# Altium project SamplerBoard.PrjPcb
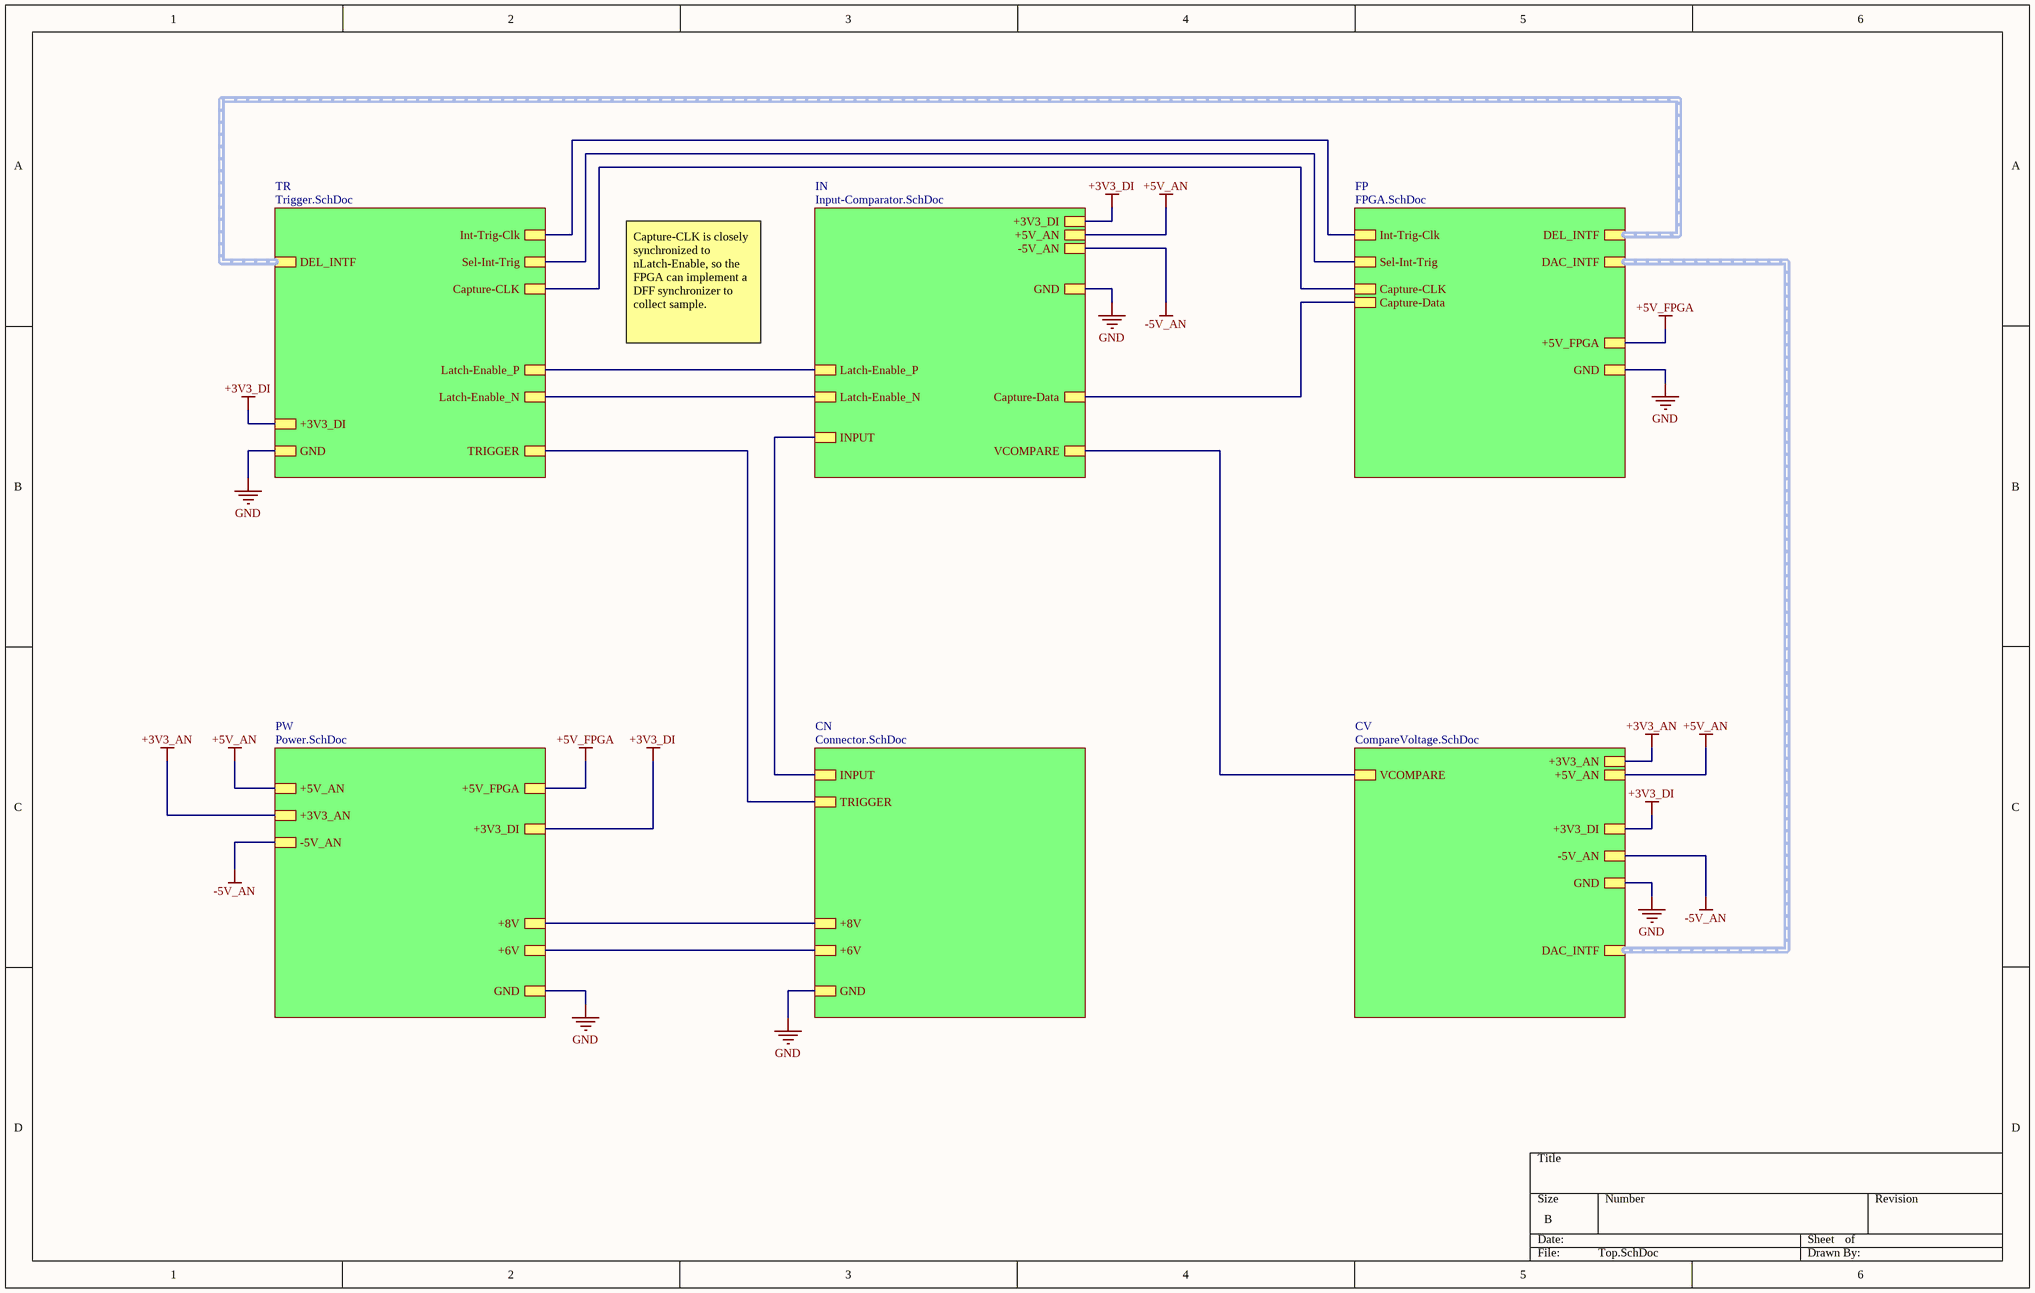
[diagram p0: Top.SchDoc]
7 sheets, 99 parts. Net scope: strictly hierarchical (ports join the sheet entries above them; power ports are local).
Board file: PCB.PcbDoc
Sheets:
  Top.SchDoc
    TR = Trigger.SchDoc
    IN = Input-Comparator.SchDoc
    FP = FPGA.SchDoc
    PW = Power.SchDoc
    CN = Connector.SchDoc
    CV = CompareVoltage.SchDoc

## Sheet Top.SchDoc
size B

### Sub-sheets
CN = Connector.SchDoc: GND, INPUT, TRIGGER, +6V, +8V
CV = CompareVoltage.SchDoc: VCOMPARE, GND, +3V3_AN, +5V_AN, -5V_AN, DAC_INTF (harness DAC_PINS), +3V3_DI
FP = FPGA.SchDoc: DAC_INTF (harness DAC_PINS), +5V_FPGA, GND, Capture-CLK, Int-Trig-Clk, Sel-Int-Trig, DEL_INTF (harness DAC_PINS), Capture-Data
IN = Input-Comparator.SchDoc: GND, +3V3_DI, +5V_AN, -5V_AN, VCOMPARE, INPUT, Latch-Enable_P, Latch-Enable_N, Capture-Data
PW = Power.SchDoc: +5V_FPGA, GND, +3V3_AN, +5V_AN, +3V3_DI, -5V_AN, +6V, +8V
TR = Trigger.SchDoc: TRIGGER, GND, +3V3_DI, Latch-Enable_P, Latch-Enable_N, Sel-Int-Trig, Capture-CLK, Int-Trig-Clk, DEL_INTF

### Nets
+3V3_AN: sheet PW/+3V3_AN, sheet CV/+3V3_AN
+3V3_DI: sheet TR/+3V3_DI, sheet IN/+3V3_DI, sheet PW/+3V3_DI, sheet CV/+3V3_DI
+5V_AN: sheet IN/+5V_AN, sheet PW/+5V_AN, sheet CV/+5V_AN
+5V_FPGA: sheet FP/+5V_FPGA, sheet PW/+5V_FPGA
+6V: sheet PW/+6V, sheet CN/+6V
+8V: sheet PW/+8V, sheet CN/+8V
-5V_AN: sheet IN/-5V_AN, sheet PW/-5V_AN, sheet CV/-5V_AN
GND: sheet TR/GND, sheet IN/GND, sheet FP/GND, sheet PW/GND, sheet CN/GND, sheet CV/GND
Latch-Enable_N: sheet TR/Latch-Enable_N, sheet IN/Latch-Enable_N
Latch-Enable_P: sheet TR/Latch-Enable_P, sheet IN/Latch-Enable_P
VCOMPARE: sheet IN/VCOMPARE, sheet CV/VCOMPARE
NetBB1_2: sheet TR/Capture-CLK, sheet FP/Capture-CLK
NetBB1_3: sheet IN/Capture-Data, sheet FP/Capture-Data
NetBB1_5: sheet TR/Sel-Int-Trig, sheet FP/Sel-Int-Trig
NetDB1_2: sheet TR/Int-Trig-Clk, sheet FP/Int-Trig-Clk
NetJ1_1: sheet IN/INPUT, sheet CN/INPUT
NetJ2_1: sheet TR/TRIGGER, sheet CN/TRIGGER

### Buses and harness runs
harness sheet CV/DAC_INTF = sheet FP/DAC_INTF
harness sheet FP/DEL_INTF = sheet TR/DEL_INTF

### Notes on the sheet
- Capture-CLK is closely synchronized to nLatch-Enable, so the FPGA can implement a DFF synchronizer to collect sample.

## Sheet Trigger.SchDoc
size B
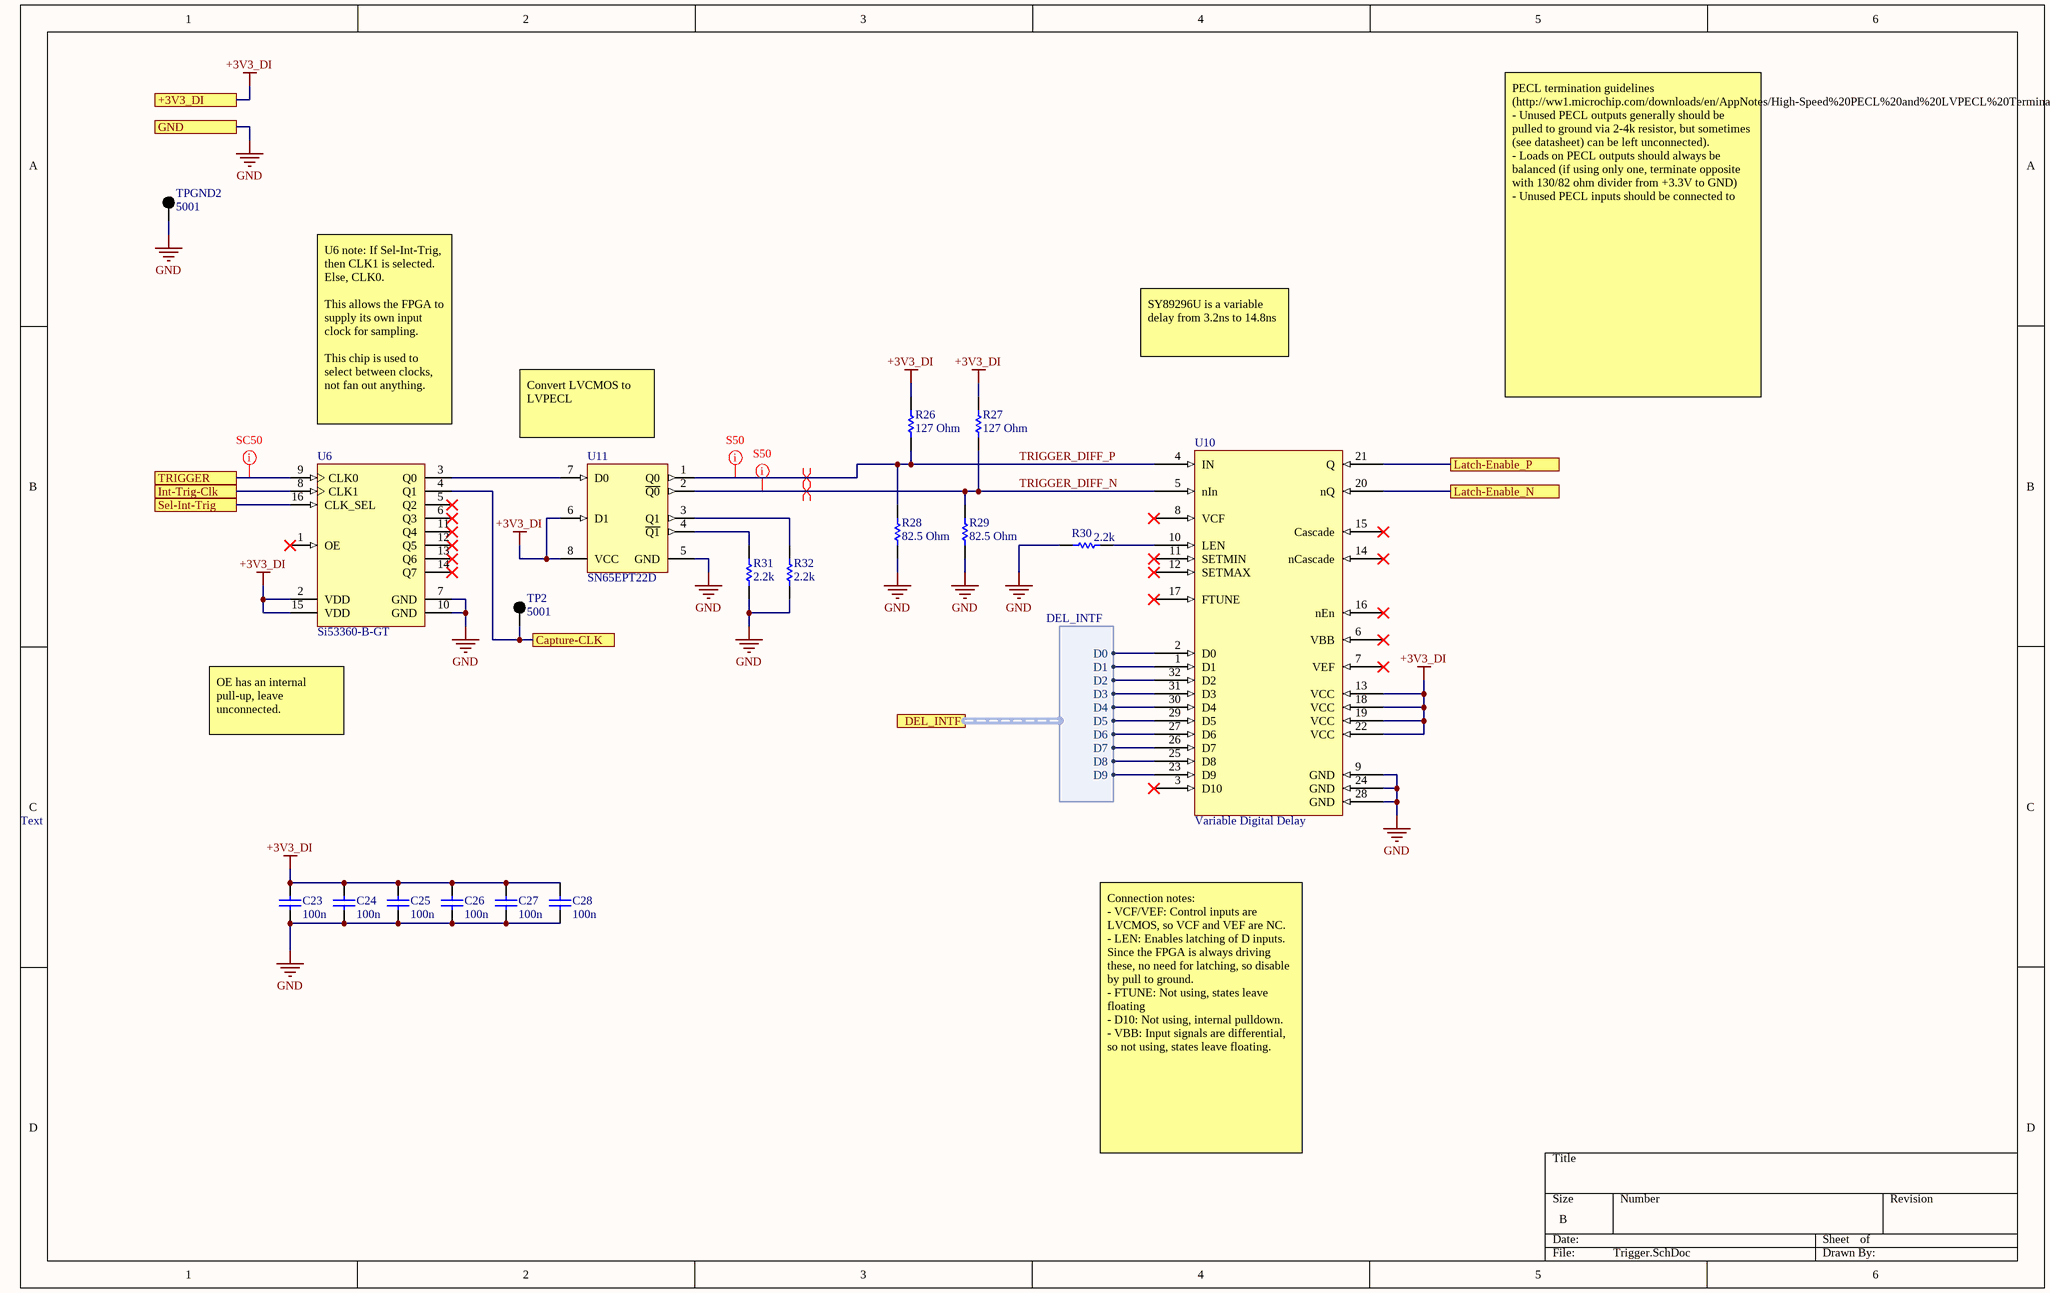
[diagram p1: Trigger.SchDoc]

### Parts
C23  value 100n  [CAPC2013X88X50NL20T25]  (hidden comment: C0805C104K5RACTU)
C24  value 100n  [CAPC2013X88X50NL20T25]  (hidden comment: C0805C104K5RACTU)
C25  value 100n  [CAPC2013X88X50NL20T25]  (hidden comment: C0805C104K5RACTU)
C26  value 100n  [CAPC2013X88X50NL20T25]  (hidden comment: C0805C104K5RACTU)
C27  value 100n  [CAPC2013X88X50NL20T25]  (hidden comment: C0805C104K5RACTU)
C28  value 100n  [CAPC2013X88X50NL20T25]  (hidden comment: C0805C104K5RACTU)
R26  127 Ohm  [RESC2013X50X30NL20T20]
R27  127 Ohm  [RESC2013X50X30NL20T20]
R28  82.5 Ohm  [RESC2013X50X30ML20T20]
R29  82.5 Ohm  [RESC2013X50X30ML20T20]
R30  2.2k  [RESC2013X50X30NL20T20]
R31  2.2k  [RESC2013X50X30NL20T20]
R32  2.2k  [RESC2013X50X30NL20T20]
TP2  5001  [KSTN-5001]
TPGND2  5001  [KSTN-5001]
U6  Si53360-B-GT  [SLAB-TSSOP-16_M]
U10  Variable Digital Delay  [CQFP80P1115X1115X120-32N]
U11  SN65EPT22D  [D0008A_M]

### Ports
+3V3_DI, Capture-CLK, DEL_INTF (harness DEL_INTF), GND, Int-Trig-Clk, Latch-Enable_N, Latch-Enable_P, Sel-Int-Trig, TRIGGER

### Harnesses
DEL_INTF: D0, D1, D2, D3, D4, D5, D6, D7, D8, D9

### Nets
+3V3_DI: C23.2 C24.2 C25.2 C26.2 C27.2 C28.2 R26.2 R27.2 U6.2(VDD) U6.15(VDD) U10.13(VCC) U10.18(VCC) U10.19(VCC) U10.22(VCC) U11.6(D1) U11.8(VCC) ; port +3V3_DI
GND: C23.1 C24.1 C25.1 C26.1 C27.1 C28.1 R28.1 R29.1 R30.1 R31.2 R32.2 TPGND2.1 U6.7(GND) U6.10(GND) U10.9(GND) U10.24(GND) U10.28(GND) U11.5(GND) ; port GND
D0: U10.2(D0) ; port DEL_INTF.D0
D1: U10.1(D1) ; port DEL_INTF.D1
D2: U10.32(D2) ; port DEL_INTF.D2
D3: U10.31(D3) ; port DEL_INTF.D3
D4: U10.30(D4) ; port DEL_INTF.D4
D5: U10.29(D5) ; port DEL_INTF.D5
D6: U10.27(D6) ; port DEL_INTF.D6
D7: U10.26(D7) ; port DEL_INTF.D7
D8: U10.25(D8) ; port DEL_INTF.D8
D9: U10.23(D9) ; port DEL_INTF.D9
Latch-Enable_N: U10.20(nQ) ; port Latch-Enable_N
Latch-Enable_P: U10.21(Q) ; port Latch-Enable_P
TRIGGER_DIFF_N: R27.1 R29.2 U10.5(nIn) U11.2(~{Q0})
TRIGGER_DIFF_P: R26.1 R28.2 U10.4(IN) U11.1(Q0)
NetBB1_2: TP2.1 U6.4(Q1) ; port Capture-CLK
NetBB1_5: U6.16(CLK_SEL) ; port Sel-Int-Trig
NetDB1_2: U6.8(CLK1) ; port Int-Trig-Clk
NetJ2_1: U6.9(CLK0) ; port TRIGGER
NetR30_2: R30.2 U10.10(LEN)
NetR31_1: R31.1 U11.4(~{Q1})
NetR32_1: R32.1 U11.3(Q1)
NetU6_3: U6.3(Q0) U11.7(D0)

Not connected (* = marked no-connect by the designer): U6 1(OE)* 5(Q2)* 6(Q3)* 11(Q4)* 12(Q5)* 13(Q6)* 14(Q7)*; U10 3(D10)* 6(VBB)* 7(VEF)* 8(VCF)* 11(SETMIN)* 12(SETMAX)* 14(nCascade)* 15(Cascade)* 16(nEn)* 17(FTUNE)*

### Layout directives
net class SC50: NetJ2_1
net class S50: TRIGGER_DIFF_N, TRIGGER_DIFF_P
differential pair: TRIGGER_DIFF_N, TRIGGER_DIFF_P

### Notes on the sheet
- SY89296U is a variable delay from 3.2ns to 14.8ns
- U6 note: If Sel-Int-Trig, then CLK1 is selected. Else, CLK0.
  This allows the FPGA to supply its own input clock for sampling.
  This chip is used to select between clocks, not fan out anything.
- (near U11) Convert LVCMOS to LVPECL
- PECL termination guidelines (http://ww1.microchip.com/downloads/en/AppNotes/High-Speed%20PECL%20and%20LVPECL%20Termination.pdf):
  - Unused PECL outputs generally should be pulled to ground via 2-4k resistor, but sometimes (see datasheet) can be left unconnected).
  - Loads on PECL outputs should always be balanced (if using only one, terminate opposite with 130/82 ohm divider from +3.3V to GND)
  - Unused PECL inputs should be connected to
- OE has an internal pull-up, leave unconnected.
- Text
- Connection notes:
  - VCF/VEF: Control inputs are LVCMOS, so VCF and VEF are NC.
  - LEN: Enables latching of D inputs. Since the FPGA is always driving these, no need for latching, so disable by pull to ground.
  - FTUNE: Not using, states leave floating
  - D10: Not using, internal pulldown.
  - VBB: Input signals are differential, so not using, states leave floating.

### Library data of the parts
C23-C28 = CMP-2007-00279-1: Manufacturer: Kemet; Part Number: C0805C104K5RACTU
R26 R27 = CMP-2001-04933-1: Manufacturer: Vishay Dale; Part Number: CRCW0805127RFKEA
R28 R29 = CMP-2001-04138-1: Part Number: CRCW080582R5FKEA; Manufacturer: Vishay Dale
R30-R32 = CMP-2001-03760-1: Part Number: CRCW08052K20FKEA; Manufacturer: Vishay Dale
TP2 TPGND2 = CMP-2000-05181-1: Test Point, Black, 1-Pin THD, RoHS, Bulk; Manufacturer: Keystone; Other Names: 5001K; Catalog Drawings: 5000Series; Alternate Color: 5004K-ND / -TESTPOINTPCMINI.040"DYELLOW / 5003K-ND / -TESTPOINTPCMINI.040"DORANGE / 5002K-ND / -TESTPOINTPCMINI.040"DWHITE / 5000K-ND / -TESTPOINTPCMINI.040"DRED; Kits: DKTGRS232C-KIT-ND / -TTLCONVERTER; Online Catalog: ColorCodedTestPoints; Datasheet URL: https://ciiva.com/datasheet-click-2917627?src=ciiva&sig=bd195616; Mounting Type: 0.040"(1.02mm)HoleDiameter; Family: TestPoints; RoHS Information: RoHSComplianceStatement; Datasheet Version: Rev. G, 12/2008; Color: Black; Category: TestandMeasurement; Standard Package: 100; Manufacturer URL: http://www.keyelco.com/; Material: Base,Nylon46,UL94V-0; Type: PCTestPoint,Miniature; Terminal: 0.010"x0.020"(0.25mmx0.51mm)PhosphorBronzeWire,SilverPlated; Series: THM; Packaging: Bulk
U6 = CMP-0510-00562-1: 1:8 Low Jitter CMOS Clock Buffer with 2:1 Input Mux, 1 to 200 MHz, -40 to 85 degC, 16-pin SOP; Manufacturer: Silicon Labs; Sub-Family: Clock Buffers; Output Format: LVCMOS; Frequency (MHz): 1 to 200; Mounting Technology: Surface Mount; ComponentLink3Description: Package Specification; PartNumber: Si53360-B-GT; PackageReference: TSSOP-16; ComponentLink2URL: http://www.silabs.com/Support%20Documents/TechnicalDocs/Si53360.pdf; DatasheetVersion: Rev. 0.4; Code_IPC: J-STD-020C; PackageDescription: 16-Pin Thin Shrink Small-Outline Package, Body 5 x 4.4 mm, Pitch 0.65 mm; Code_JEDEC: MO-153; ComponentLink1Description: Manufacturer URL; ComponentLink3URL: http://www.silabs.com/Support%20Documents/TechnicalDocs/Si53360.pdf; ComponentLink2Description: Datasheet; ComponentLink1URL: http://www.silabs.com/
U10 = SY89296U
U11 = CMP-0327-00041-3: 4000 Mbps 3.3 V Dual LVTTL / LVCMOS to Differential LVPECL Buffer, 2 Tx and 2 Rx, -40 to +85 degC, 8-pin SOIC (D), Green (RoHS & no Sb/Br); Manufacturer: Texas Instruments; No. of Tx: 2; SubFamily: PECL PHY; ICC(Max)(mA): 50; Signaling Rate(Mbps): 4000; xECL: TRUE; Input Signal: LVTTL, CMOS; PackageDescription: 8-Pin Plastic Small Outline Integrated Circuit, 4.9 x 3.9 mm, Pitch 1.27 mm Pitch; ComponentLink1Description: Manufacturer URL; No. of Rx: 2; Eco-Plan: Green (RoHS & no Sb/Br); Mounting Technology: Surface Mount; ComponentLink2URL: http://www.ti.com/general/docs/lit/getliterature.tsp?genericPartNumber=SN65EPT22&fileType=pdf; ComponentLink3URL: SamplesURL:http://www.ti.com/product/sn65ept22#samples; DatasheetVersion: SLLS926A; PartNumber: SN65EPT22D; PackageReference: D0008A; ComponentLink2Description: Datasheet; ComponentLink1URL: http://www.ti.com/; ComponentLink3Description: URL Link1; Output Signal: LVPECL; PackageVersion: revM, Jun-2011

## Sheet Input-Comparator.SchDoc
size B
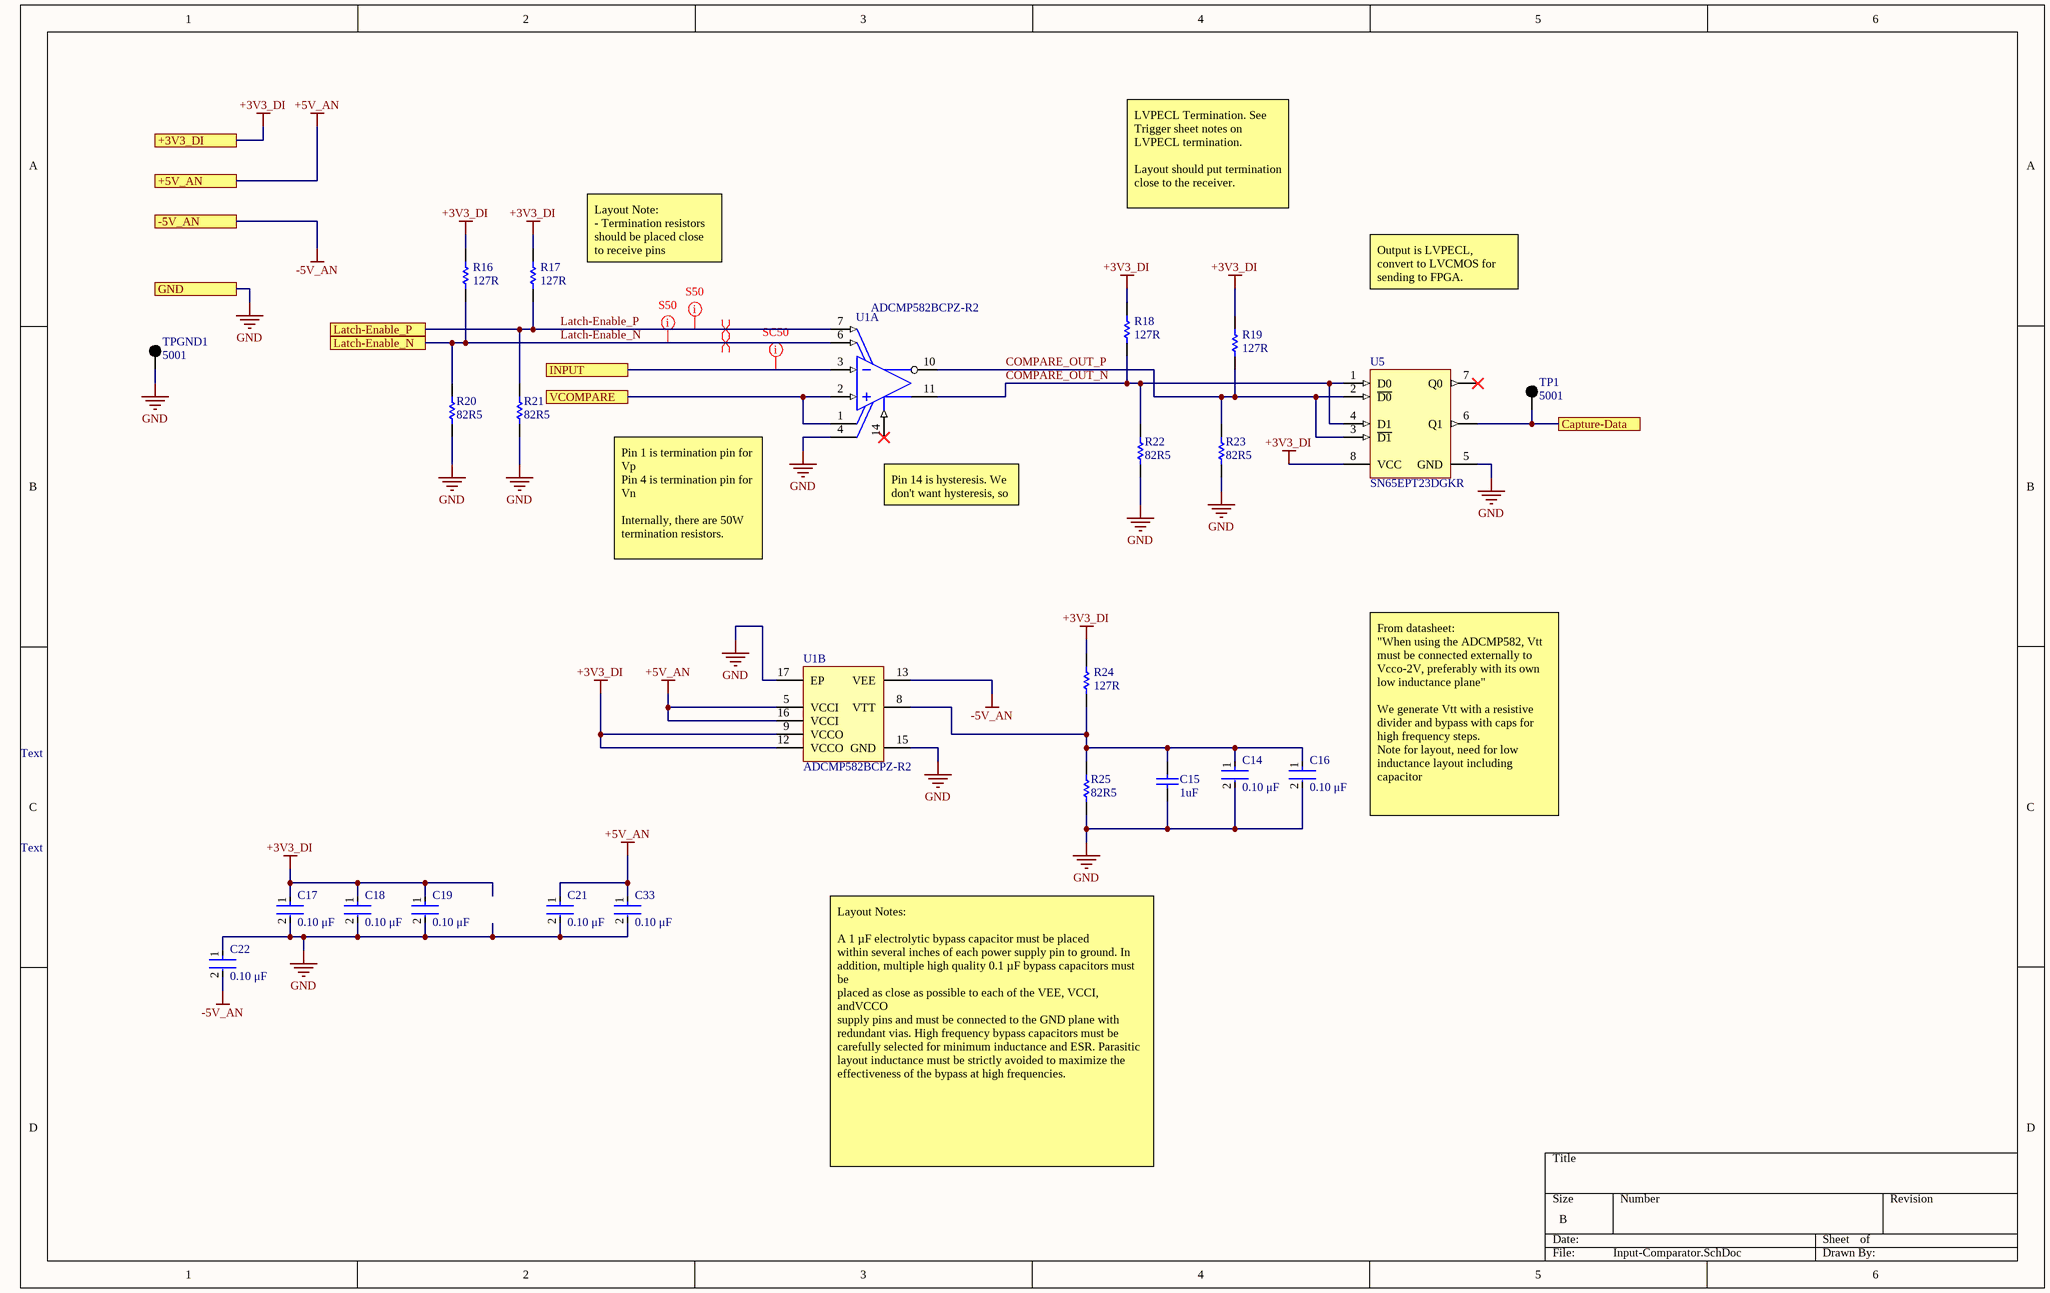
[diagram p2: Input-Comparator.SchDoc]

### Parts
C14  Capacitance: 0.10 μF  [FP-C0402-BB-MFG]  (hidden comment: C0402C104K8PACTU)
C15  1uF  [CAPC2013X100X50NL20T25]
C16  Capacitance: 0.10 μF  [FP-C0402-BB-MFG]  (hidden comment: C0402C104K8PACTU)
C17  Capacitance: 0.10 μF  [FP-C0402-BB-MFG]  (hidden comment: C0402C104K8PACTU)
C18  Capacitance: 0.10 μF  [FP-C0402-BB-MFG]  (hidden comment: C0402C104K8PACTU)
C19  Capacitance: 0.10 μF  [FP-C0402-BB-MFG]  (hidden comment: C0402C104K8PACTU)
C21  Capacitance: 0.10 μF  [FP-C0402-BB-MFG]  (hidden comment: C0402C104K8PACTU)
C22  Capacitance: 0.10 μF  [FP-C0402-BB-MFG]  (hidden comment: C0402C104K8PACTU)
C33  Capacitance: 0.10 μF  [FP-C0402-BB-MFG]  (hidden comment: C0402C104K8PACTU)
R16  value 127R  [RESC1005X40X25LL05T10]  (hidden comment: RC0402FR-07127RL)
R17  value 127R  [RESC1005X40X25LL05T10]  (hidden comment: RC0402FR-07127RL)
R18  value 127R  [RESC1005X40X25LL05T10]  (hidden comment: RC0402FR-07127RL)
R19  value 127R  [RESC1005X40X25LL05T10]  (hidden comment: RC0402FR-07127RL)
R20  value 82R5  [RESC1005X40X25LL05T10]  (hidden comment: RC0402FR-0782R5L)
R21  value 82R5  [RESC1005X40X25LL05T10]  (hidden comment: RC0402FR-0782R5L)
R22  value 82R5  [RESC1005X40X25LL05T10]  (hidden comment: RC0402FR-0782R5L)
R23  value 82R5  [RESC1005X40X25LL05T10]  (hidden comment: RC0402FR-0782R5L)
R24  value 127R  [RESC1005X40X25LL05T10]  (hidden comment: RC0402FR-07127RL)
R25  value 82R5  [RESC1005X40X25LL05T10]  (hidden comment: RC0402FR-0782R5L)
TP1  5001  [KSTN-5001]
TPGND1  5001  [KSTN-5001]
U1  ADCMP582BCPZ-R2  [ADI-CP-16-3_L]  (parts A,B of 2)
U5  SN65EPT23DGKR  [DGK0008A_L]

### Ports
+3V3_DI, +5V_AN, -5V_AN, Capture-Data, GND, INPUT, Latch-Enable_N, Latch-Enable_P, VCOMPARE

### Nets
+3V3_DI: C17.1 C18.1 C19.1 R16.2 R17.2 R18.2 R19.2 R24.2 U1.9(VCCO) U1.12(VCCO) U5.8(VCC) ; port +3V3_DI
+5V_AN: C21.1 C33.1 U1.5(VCCI) U1.16(VCCI) ; port +5V_AN
-5V_AN: C22.2 U1.13(VEE) ; port -5V_AN
GND: C14.2 C15.1 C16.2 C17.2 C18.2 C19.2 C21.2 C22.1 C33.2 R20.1 R21.1 R22.1 R23.1 R25.1 TPGND1.1 U1.4(VTN) U1.15(GND) U1.17(EP) U5.5(GND) ; port GND
COMPARE_OUT_N: R18.1 R22.2 U1.11(Q) U5.1(D0) U5.4(D1)
COMPARE_OUT_P: R19.1 R23.2 U1.10(~{Q}) U5.2(~{D0}) U5.3(~{D1})
Latch-Enable_N: R16.1 R20.2 U1.6(~{LE}) ; port Latch-Enable_N
Latch-Enable_P: R17.1 R21.2 U1.7(LE) ; port Latch-Enable_P
VCOMPARE: U1.1(VTP) U1.2(VP) ; port VCOMPARE
NetBB1_3: TP1.1 U5.6(Q1) ; port Capture-Data
NetC14_1: C14.1 C15.2 C16.1 R24.1 R25.2 U1.8(VTT)
NetJ1_1: U1.3(VN) ; port INPUT

Not connected (* = marked no-connect by the designer): U1 14(HYS)*; U5 7(Q0)*

### Layout directives
differential pair: Latch-Enable_N, Latch-Enable_P
net class SC50: NetJ1_1
net class S50: Latch-Enable_N, Latch-Enable_P

### Notes on the sheet
- LVPECL Termination. See Trigger sheet notes on LVPECL termination.
  Layout should put termination close to the receiver.
- Layout Note:
  - Termination resistors should be placed close to receive pins
- Output is LVPECL, convert to LVCMOS for sending to FPGA.
- (near U1) Pin 14 is hysteresis. We don't want hysteresis, so leave unconnected.
- Pin 1 is termination pin for Vp
  Pin 4 is termination pin for Vn
  Internally, there are 50W termination resistors.
- Text
- From datasheet:
  "When using the ADCMP582, Vtt must be connected externally to Vcco-2V, preferably with its own low inductance plane"
  We generate Vtt with a resistive divider and bypass with caps for high frequency steps.
  Note for layout, need for low inductance layout including capacitor
- Layout Notes:
  A 1 µF electrolytic bypass capacitor must be placed
  within several inches of each power supply pin to ground. In
  addition, multiple high quality 0.1 µF bypass capacitors must be
  placed as close as possible to each of the VEE, VCCI, andVCCO
  supply pins and must be connected to the GND plane with
  redundant vias. High frequency bypass capacitors must be
  carefully selected for minimum inductance and ESR. Parasitic
  layout inductance must be strictly avoided to maximize the
  effectiveness of the bypass at high frequencies.

### Library data of the parts
C14 C16-C19 C21 C22 C33 = CMP-2008-02046-2: CAP CER 0.1UF 10V X5R 0402; Manufacturer: Kemet; Material: Ceramic; Temperature Coefficient: 15%; Tolerance: 0.1; Value: 0.10 μF; Package: C0402-BB; Temperature: -55°C to +125°C; ComponentLink2Description: Datasheet; Temperature Characteristic: X5R; Device Class L1: Passive Components; Height: 0.55mm; Lead Free: Yes; ComponentLink2URL: https://content.kemet.com/datasheets/KEM_C1002_X7R_SMD.pdf; Device Class L2: Capacitors; Temperature Range Low: -55°C; Temperature Range High: +125°C; RoHS: TRUE; Octopart: https://octopart.com/c0402c104k8pactu-kemet-140039; Automotive: No; Mouser Description: Capacitor 100 nF 10 VDC 0402; Category: Cap; Voltage Rating: 10 V; Digikey Description: CAP CER 0.1UF 10V X5R 0402; Ipc Land Pattern Name: CAPC10050X50; Device Class L3: Ceramic Capacitors; Manufacturer Part Number: C0402C104K8PACTU
C15 = CMP-2007-03716-1: Part Number: C0805X105K3RACTU; Manufacturer: Kemet
R16-R19 R24 = CMP-2002-07170-1: Manufacturer: Yageo / Phycomp; Part Number: RC0402FR-07127RL
R20-R23 R25 = CMP-2002-07819-1: Manufacturer: Yageo / Phycomp; Part Number: RC0402FR-0782R5L
TP1 TPGND1 = CMP-2000-05181-1: as TP2 on sheet Trigger; Datasheet URL: https://ciiva.com/datasheet-click-2917627?src=ciiva&sig=bd195616; Mounting Type: 0.040"(1.02mm)HoleDiameter; Family: TestPoints; RoHS Information: RoHSComplianceStatement; Datasheet Version: Rev. G, 12/2008; Color: Black; Category: TestandMeasurement; Standard Package: 100; Manufacturer URL: http://www.keyelco.com/; Material: Base,Nylon46,UL94V-0; Type: PCTestPoint,Miniature; Terminal: 0.010"x0.020"(0.25mmx0.51mm)PhosphorBronzeWire,SilverPlated; Series: THM; Packaging: Bulk
U1 = CMP-0783-00019-1: Ultrafast SiGe Voltage Comparator, + / - 5 V, 180 ps Delay, Industrial, 16-pin QFN (CP-16-3), Reel; Manufacturer: Analog Devices; Input Range (V): -2 to 3; Voltage Supply (V): 5 to -5; ComponentLink2URL: http://www.analog.com/static/imported-files/data_sheets/ADCMP580_581_582.pdf; ComponentLink3URL: http://www.analog.com/static/imported-files/packages/PKG_PDF/LFCSP(CP)/CP_16_3.pdf; PartNumber: ADCMP582BCPZ-R2; Mounting Technology: Surface Mount; PackageReference: CP-16-3; PackageDescription: 16-Pin Lead Frame Chip Scale Package, Body 3 x 3 mm, Pitch 0.5 mm; Code_JEDEC: MO-220-VEED-2; ComponentLink1Description: Manufacturer URL; Packing: Reel; ComponentLink4Description: URL Link1; ComponentLink3Description: Package Specification; ComponentLink1URL: http://www.analog.com/en/index.html; ComponentLink2Description: Datasheet; DatasheetVersion: Rev. A; ComponentLink4URL: Product URL:http://www.analog.com/en/special-linear-functions/comparators/adcmp582/products/product.html
U5 = CMP-0327-00168-3: 600 Mbps 3.3 V ECL Differential Receiver with LVPECL, LVDS Input and LVTTL, CMOS Output, 2 Tx and 2 Rx, -40 to +85 degC, 8-pin VSSOP (DGK), Green (RoHS & no Sb/Br); Manufacturer: Texas Instruments; No. of Rx: 2; SubFamily: PECL PHY; Signaling Rate(Mbps): 600; ICC(Max)(mA): 25; xECL: TRUE; ComponentLink1Description: Manufacturer URL; PackageDescription: 8-Pin Thin Small Outline Package 3 x 3 mm Body ,0.65 mm Pitch; ComponentLink3Description: URL Link1; Mounting Technology: Surface Mount; DatasheetVersion: SLLS969A; ComponentLink2URL: http://www.ti.com/general/docs/lit/getliterature.tsp?genericPartNumber=SN65EPT23&fileType=pdf; Output Signal: LVTTL, CMOS; PackageVersion: revE, May-2006; Eco-Plan: Green (RoHS & no Sb/Br); PartNumber: SN65EPT23DGKR; PackageReference: DGK0008A; Input Signal: LVPECL, LVDS; No. of Tx: 2; ComponentLink1URL: http://www.ti.com/; ComponentLink2Description: Datasheet; ComponentLink3URL: SamplesURL:http://www.ti.com/product/sn65ept23#samples

## Sheet FPGA.SchDoc
size B
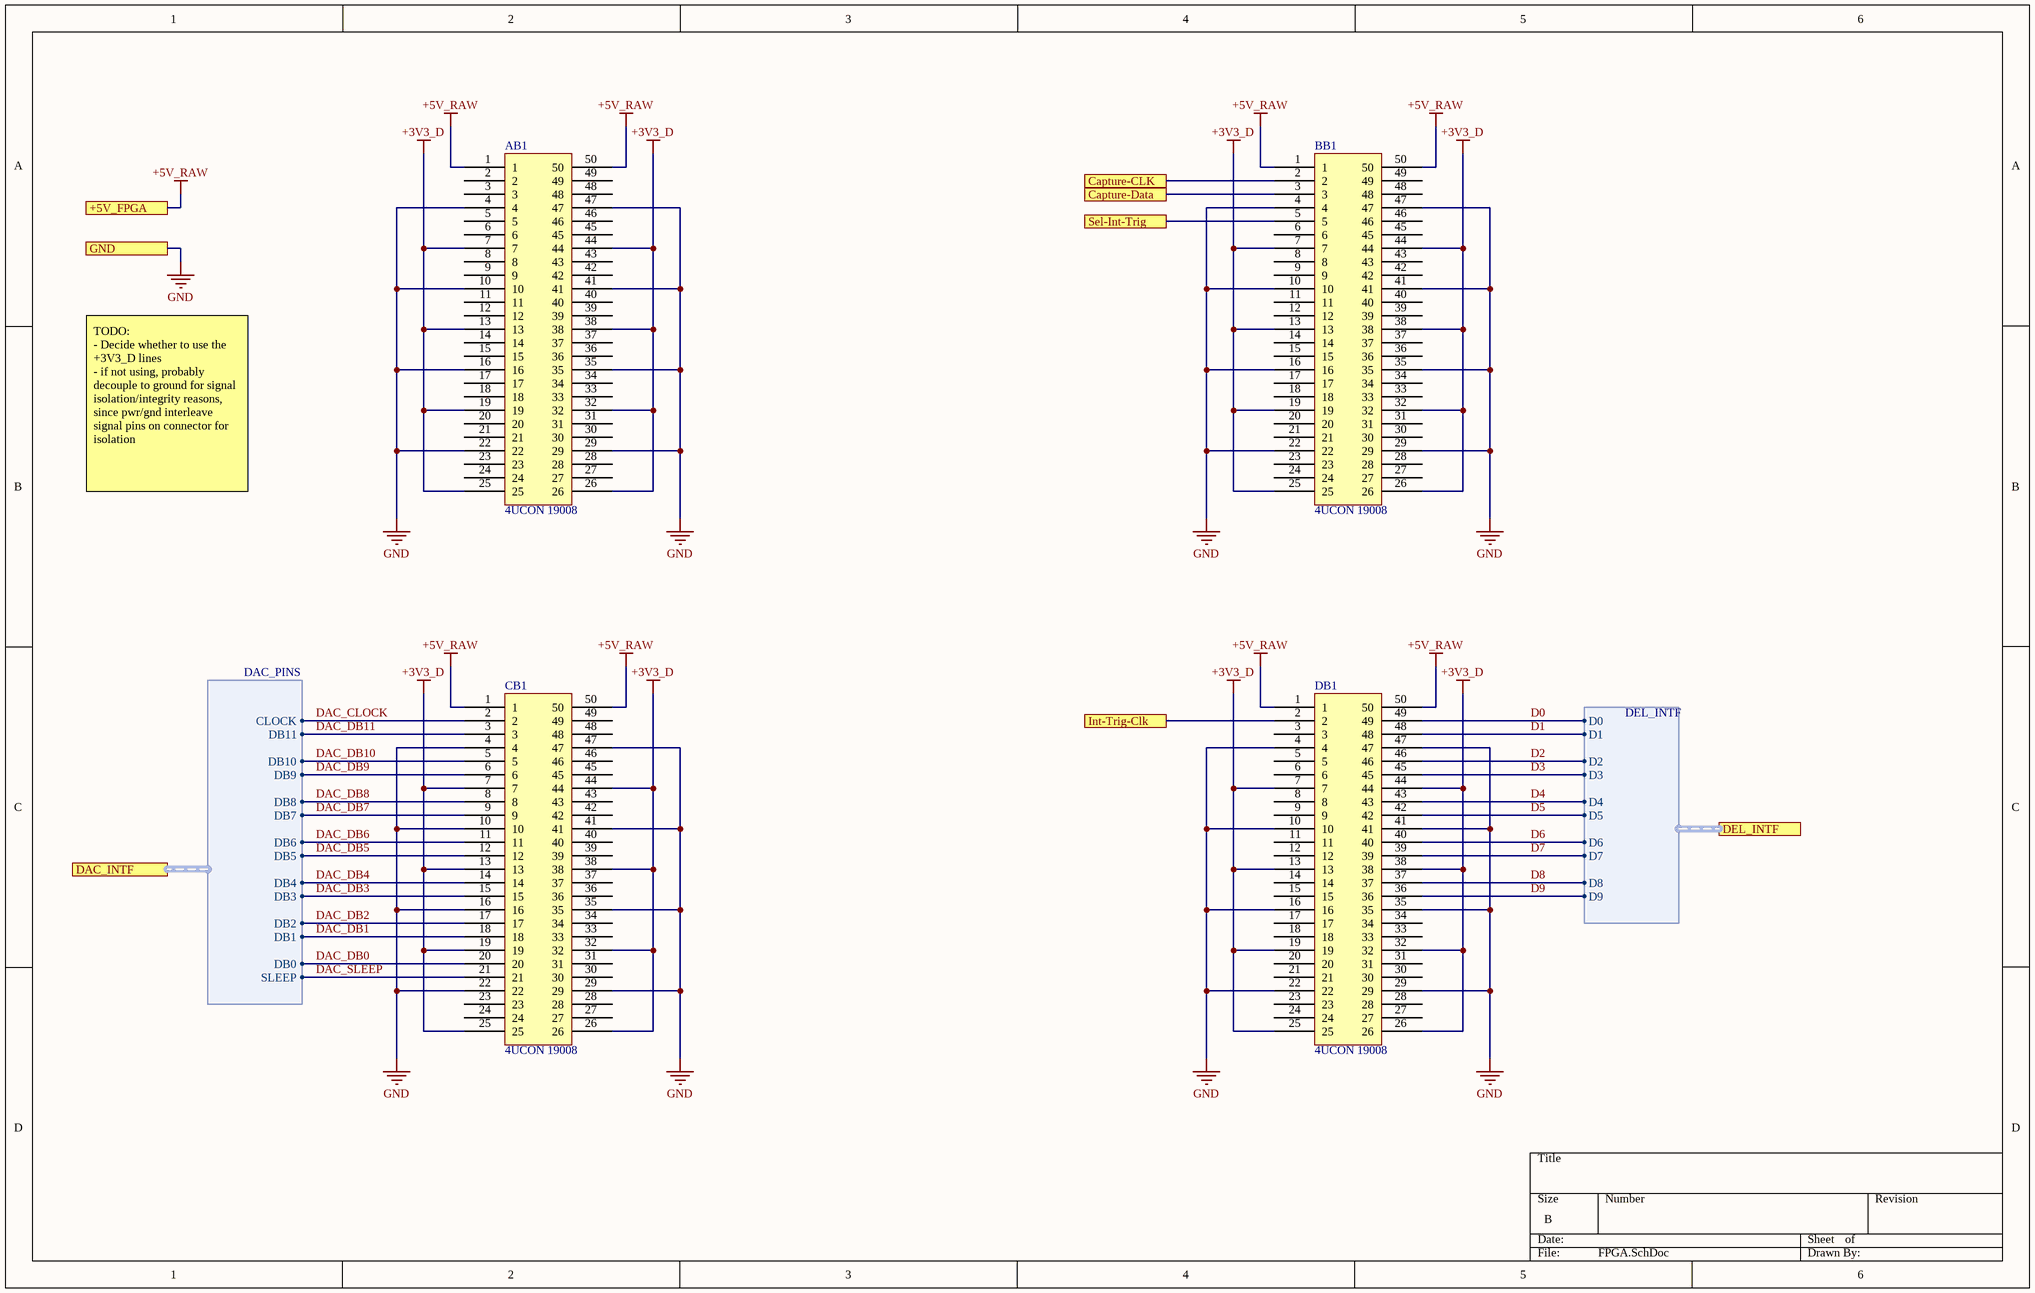
[diagram p3: FPGA.SchDoc]

### Parts
AB1  4UCON 19008  [4UCON_19008]
BB1  4UCON 19008  [4UCON_19008]
CB1  4UCON 19008  [4UCON_19008]
DB1  4UCON 19008  [4UCON_19008]

### Ports
+5V_FPGA, Capture-CLK, Capture-Data, DAC_INTF (harness DAC_PINS), DEL_INTF (harness DEL_INTF), GND, Int-Trig-Clk, Sel-Int-Trig

### Harnesses
DEL_INTF: D0, D1, D2, D3, D4, D5, D6, D7, D8, D9
DAC_PINS: DB0, DB1, DB2, DB3, DB4, DB5, DB6, DB7, DB8, DB9, DB10, DB11, CLOCK, SLEEP

### Nets
+3V3_D: AB1.7 AB1.13 AB1.19 AB1.25 AB1.26 AB1.32 AB1.38 AB1.44 BB1.7 BB1.13 BB1.19 BB1.25 BB1.26 BB1.32 BB1.38 BB1.44 CB1.7 CB1.13 CB1.19 CB1.25 CB1.26 CB1.32 CB1.38 CB1.44 DB1.7 DB1.13 DB1.19 DB1.25 DB1.26 DB1.32 DB1.38 DB1.44
+5V_RAW: AB1.1 AB1.50 BB1.1 BB1.50 CB1.1 CB1.50 DB1.1 DB1.50 ; port +5V_FPGA  [project net +5V_FPGA]
GND: AB1.4 AB1.10 AB1.16 AB1.22 AB1.29 AB1.35 AB1.41 AB1.47 BB1.4 BB1.10 BB1.16 BB1.22 BB1.29 BB1.35 BB1.41 BB1.47 CB1.4 CB1.10 CB1.16 CB1.22 CB1.29 CB1.35 CB1.41 CB1.47 DB1.4 DB1.10 DB1.16 DB1.22 DB1.29 DB1.35 DB1.41 DB1.47 ; port GND
D0: DB1.49 ; port DEL_INTF.D0
D1: DB1.48 ; port DEL_INTF.D1
D2: DB1.46 ; port DEL_INTF.D2
D3: DB1.45 ; port DEL_INTF.D3
D4: DB1.43 ; port DEL_INTF.D4
D5: DB1.42 ; port DEL_INTF.D5
D6: DB1.40 ; port DEL_INTF.D6
D7: DB1.39 ; port DEL_INTF.D7
D8: DB1.37 ; port DEL_INTF.D8
D9: DB1.36 ; port DEL_INTF.D9
DAC_CLOCK: CB1.2 ; port DAC_INTF.CLOCK
DAC_DB0: CB1.20 ; port DAC_INTF.DB0
DAC_DB1: CB1.18 ; port DAC_INTF.DB1
DAC_DB2: CB1.17 ; port DAC_INTF.DB2
DAC_DB3: CB1.15 ; port DAC_INTF.DB3
DAC_DB4: CB1.14 ; port DAC_INTF.DB4
DAC_DB5: CB1.12 ; port DAC_INTF.DB5
DAC_DB6: CB1.11 ; port DAC_INTF.DB6
DAC_DB7: CB1.9 ; port DAC_INTF.DB7
DAC_DB8: CB1.8 ; port DAC_INTF.DB8
DAC_DB9: CB1.6 ; port DAC_INTF.DB9
DAC_DB10: CB1.5 ; port DAC_INTF.DB10
DAC_DB11: CB1.3 ; port DAC_INTF.DB11
DAC_SLEEP: CB1.21 ; port DAC_INTF.SLEEP
NetBB1_2: BB1.2 ; port Capture-CLK
NetBB1_3: BB1.3 ; port Capture-Data
NetBB1_5: BB1.5 ; port Sel-Int-Trig
NetDB1_2: DB1.2 ; port Int-Trig-Clk

Not connected (* = marked no-connect by the designer): AB1 2 3 5 6 8 9 11 12 14 15 17 18 20 21 23 24 27 28 30 31 33 34 36 37 39 40 42 43 45 46 48 49; BB1 6 8 9 11 12 14 15 17 18 20 21 23 24 27 28 30 31 33 34 36 37 39 40 42 43 45 46 48 49; CB1 23 24 27 28 30 31 33 34 36 37 39 40 42 43 45 46 48 49; DB1 3 5 6 8 9 11 12 14 15 17 18 20 21 23 24 27 28 30 31 33 34

### Notes on the sheet
- TODO:
  - Decide whether to use the +3V3_D lines
  - if not using, probably decouple to ground for signal isolation/integrity reasons, since pwr/gnd interleave signal pins on connector for isolation

## Sheet Power.SchDoc
size B
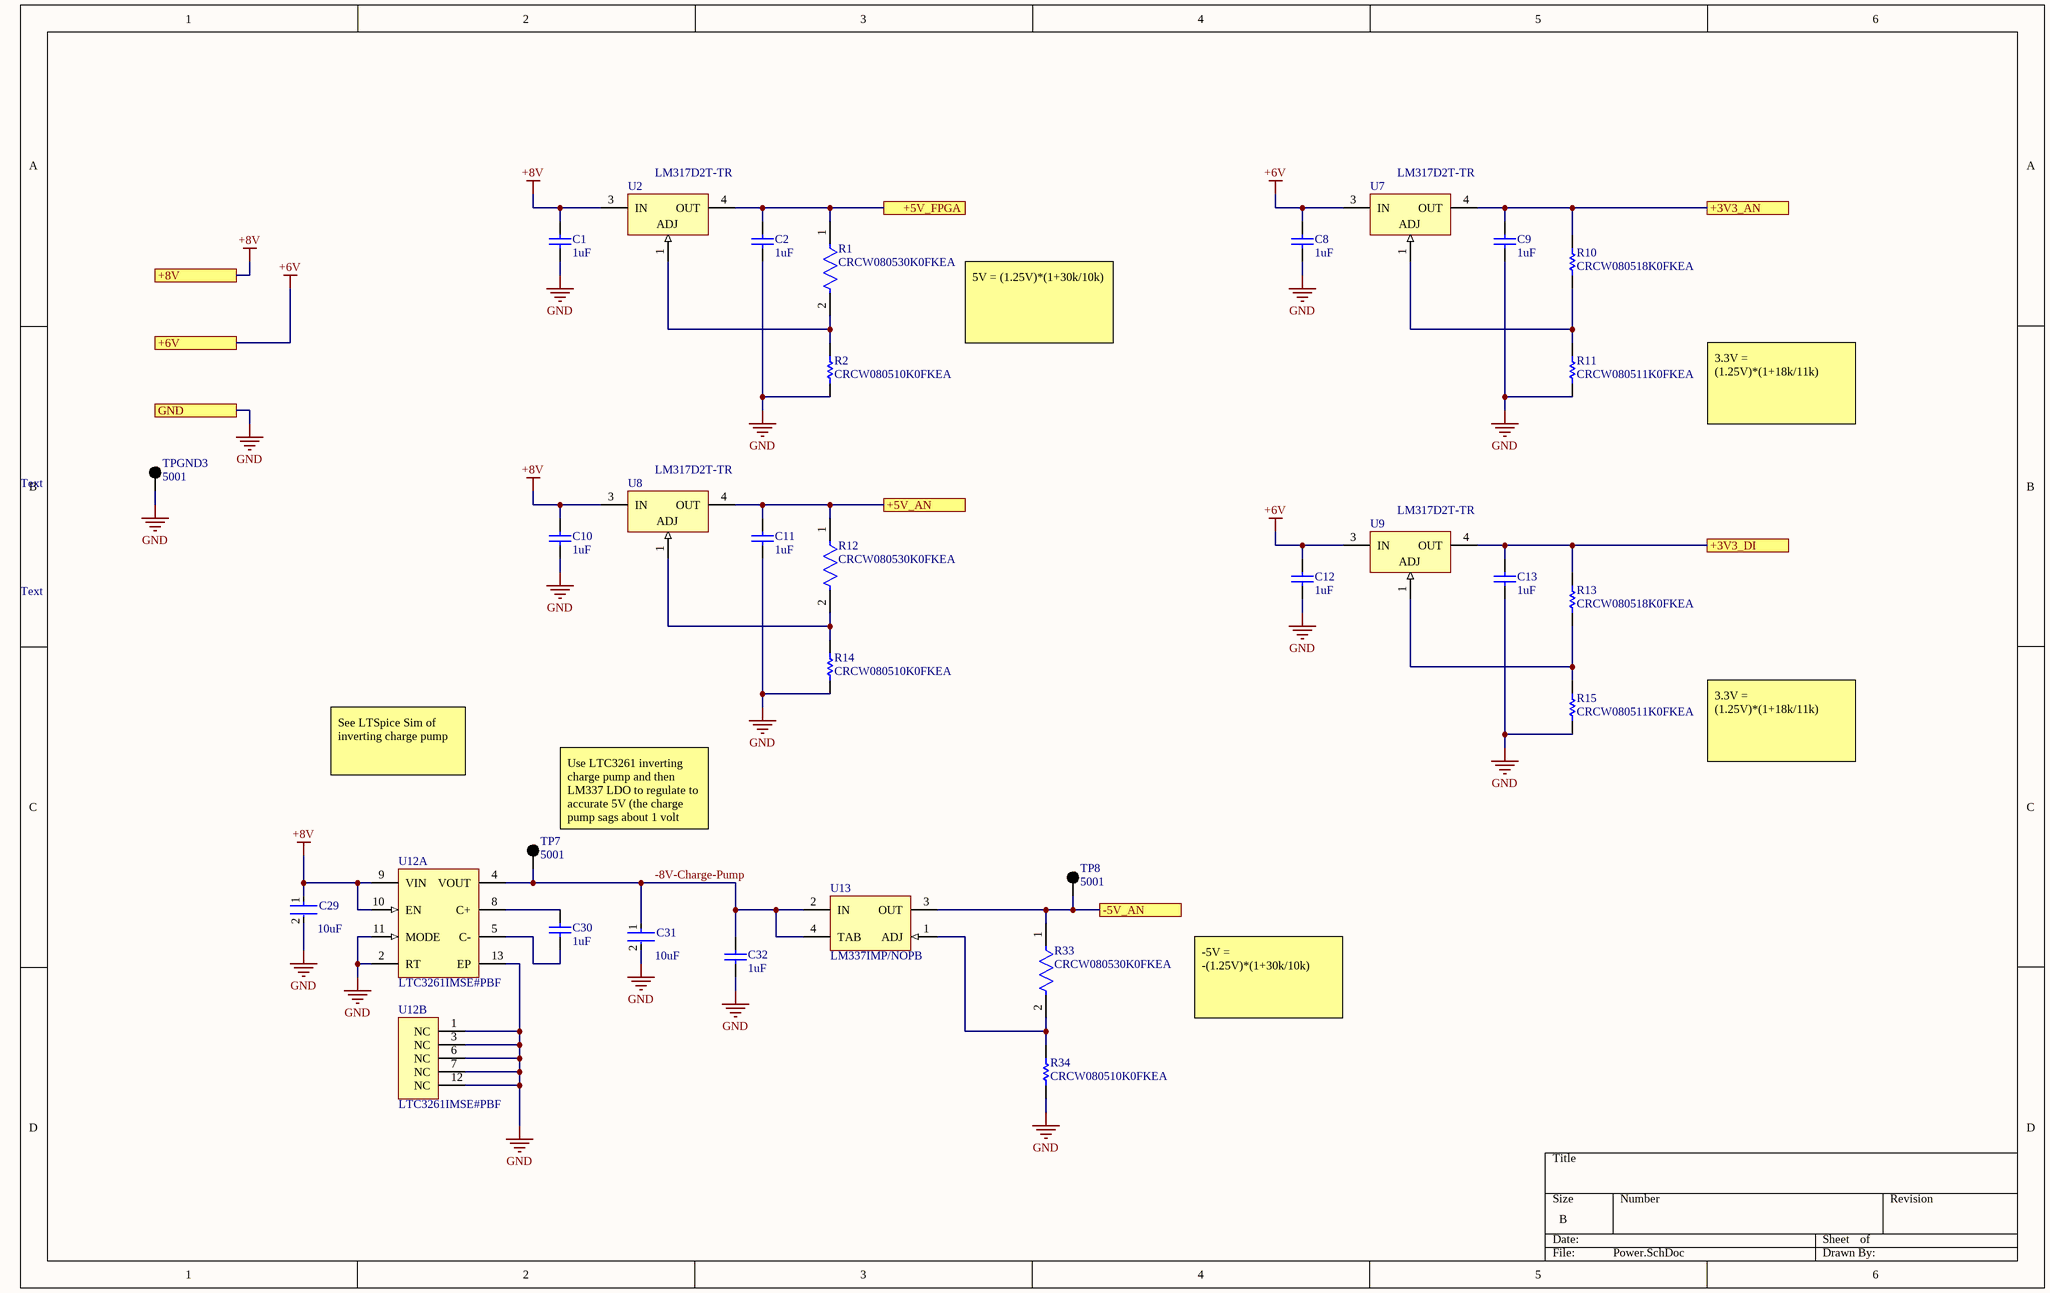
[diagram p4: Power.SchDoc]

### Parts
C1  1uF  [CAPC2013X100X50NL20T25]
C2  1uF  [CAPC2013X100X50NL20T25]
C8  1uF  [CAPC2013X100X50NL20T25]
C9  1uF  [CAPC2013X100X50NL20T25]
C10  1uF  [CAPC2013X100X50NL20T25]
C11  1uF  [CAPC2013X100X50NL20T25]
C12  1uF  [CAPC2013X100X50NL20T25]
C13  1uF  [CAPC2013X100X50NL20T25]
C29  Capacitance: 10uF  [FP-CGA5L-0_3-0_1-MFG]  (hidden comment: CGA5L1X7R1E106K160AC)
C30  1uF  [CAPC2013X100X50NL20T25]
C31  Capacitance: 10uF  [FP-CGA5L-0_3-0_1-MFG]  (hidden comment: CGA5L1X7R1E106K160AC)
C32  1uF  [CAPC2013X100X50NL20T25]
R1  CRCW080530K0FKEA  [FP-CRCW0805-e3-MFG]
R2  CRCW080510K0FKEA  [RESC2013X50X30NL20T20]
R10  CRCW080518K0FKEA  [RESC2013X50X30NL20T20]
R11  CRCW080511K0FKEA  [RESC2013X50X30NL20T20]
R12  CRCW080530K0FKEA  [FP-CRCW0805-e3-MFG]
R13  CRCW080518K0FKEA  [RESC2013X50X30NL20T20]
R14  CRCW080510K0FKEA  [RESC2013X50X30NL20T20]
R15  CRCW080511K0FKEA  [RESC2013X50X30NL20T20]
R33  CRCW080530K0FKEA  [FP-CRCW0805-e3-MFG]
R34  CRCW080510K0FKEA  [RESC2013X50X30NL20T20]
TP7  5001  [KSTN-5001]
TP8  5001  [KSTN-5001]
TPGND3  5001  [KSTN-5001]
U2  LM317D2T-TR  [TO-263_N]
U7  LM317D2T-TR  [TO-263_N]
U8  LM317D2T-TR  [TO-263_N]
U9  LM317D2T-TR  [TO-263_N]
U12  LTC3261IMSE#PBF  [LT-MSE-12-EDP_M]  (parts A,B of 2)
U13  LM337IMP/NOPB  [DCY0004A_L]

### Ports
+3V3_AN, +3V3_DI, +5V_AN, +5V_FPGA, +6V, +8V, -5V_AN, GND

### Nets
+3V3_AN: C9.2 R10.2 U7.4(OUT) ; port +3V3_AN
+3V3_DI: C13.2 R13.2 U9.4(OUT) ; port +3V3_DI
+5V_AN: C11.2 R12.1 U8.4(OUT) ; port +5V_AN
+5V_FPGA: C2.2 R1.1 U2.4(OUT) ; port +5V_FPGA
+6V: C8.2 C12.2 U7.3(IN) U9.3(IN) ; port +6V
+8V: C1.2 C10.2 C29.1 U2.3(IN) U8.3(IN) U12.9(VIN) U12.10(EN) ; port +8V
-5V_AN: R33.1 TP8.1 U13.3(OUT) ; port -5V_AN
GND: C1.1 C2.1 C8.1 C9.1 C10.1 C11.1 C12.1 C13.1 C29.2 C31.2 C32.1 R2.2 R11.1 R14.2 R15.1 R34.2 TPGND3.1 U12.1(NC) U12.2(RT) U12.3(NC) U12.6(NC) U12.7(NC) U12.11(MODE) U12.12(NC) U12.13(EP) ; port GND
-8V-Charge-Pump: C31.1 C32.2 TP7.1 U12.4(VOUT) U13.2(IN) U13.4(TAB)
NetC30_1: C30.1 U12.5(C-)
NetC30_2: C30.2 U12.8(C+)
NetR1_2: R1.2 R2.1 U2.1(ADJ)
NetR10_1: R10.1 R11.2 U7.1(ADJ)
NetR12_2: R12.2 R14.1 U8.1(ADJ)
NetR13_1: R13.1 R15.2 U9.1(ADJ)
NetR33_2: R33.2 R34.1 U13.1(ADJ)

### Notes on the sheet
- 5V = (1.25V)*(1+30k/10k)
- 3.3V = (1.25V)*(1+18k/11k)
- Text
- See LTSpice Sim of inverting charge pump
- (near TP7) Use LTC3261 inverting charge pump and then LM337 LDO to regulate to accurate 5V (the charge pump sags about 1 volt under load).
- -5V = -(1.25V)*(1+30k/10k)

### Library data of the parts
C1 C2 C8-C13 C30 C32 = CMP-2007-03716-1: as C15 on sheet Input-Comparator
C29 C31 = CMP-08246-002126-1: Cap Ceramic 10uF 25V X7R 10% Pad SMD 1206 +125°C Automotive T/R; Case/Package: 1206; Thickness: 0.075inch; Ratings: AEC-Q200; Packaging: Tape and Reel; REACH SVHC: No SVHC; Composition: Ceramic; Tolerance: 10%; Depth: 1.6mm; Lead Free: Lead Free; Termination: SMD/SMT; Package Quantity: 1; Dielectric: X7R; Length: 3.2mm; Min Operating Temperature: -55°C; Voltage Rating: 25V; Max Operating Temperature: 125°C; Mount: Surface Mount; Case Code (Metric): 3216; Height: 1.6mm; Weight: 0.000571oz; Width: 0.063inch; Voltage Rating (DC): 25V; Case Code (Imperial): 1206
R1 R12 R33 = CMP-02407-008264-1: RES Thick Film, 30kΩ, 1%, 0.125W, 100ppm/°C, 0805; Max Power Dissipation: 125mW; Voltage Rating (DC): 150V; Resistance: 30kR; Contact Plating: Tin; Weight: 0.000194oz; Temperature Coefficient: 100ppm/°C; Packaging: Tape and Reel; Height: 0.45mm; Case Code (Imperial): 0805; Max Operating Temperature: 155°C; Case/Package: 0805; Package Quantity: 10; Case Code (Metric): 2012; Features: Automotive AEC-Q200; Mount: Surface Mount; Length: 2mm; Termination: SMD/SMT; Lead Free: Lead Free; Width: 0.049inch; Number of Pins: 2; Depth: 1.25mm; Min Operating Temperature: -55°C; Power Rating: 125mW; Voltage Rating: 150V; Military Standard: Not; Composition: Thick Film; Tolerance: 1%; Number of Terminations: 2; Radiation Hardening: No
R2 R14 R34 = CMP-2001-04908-1: Manufacturer: Vishay Dale; Part Number: CRCW080510K0FKEA
R10 R13 = CMP-2001-03588-1: Manufacturer: Vishay Dale; Part Number: CRCW080518K0FKEA
R11 R15 = CMP-2001-04924-1: Manufacturer: Vishay Dale; Part Number: CRCW080511K0FKEA
TP7 TP8 TPGND3 = CMP-2000-05181-1: as TP2 on sheet Trigger; Datasheet URL: https://ciiva.com/datasheet-click-2917627?src=ciiva&sig=bd195616; Mounting Type: 0.040"(1.02mm)HoleDiameter; Family: TestPoints; RoHS Information: RoHSComplianceStatement; Datasheet Version: Rev. G, 12/2008; Color: Black; Category: TestandMeasurement; Standard Package: 100; Manufacturer URL: http://www.keyelco.com/; Material: Base,Nylon46,UL94V-0; Type: PCTestPoint,Miniature; Terminal: 0.010"x0.020"(0.25mmx0.51mm)PhosphorBronzeWire,SilverPlated; Series: THM; Packaging: Bulk
U2 U7-U9 = CMP-0244-00094-1: 1.5A, 1.2V to 37V Adjustable Voltage Regulator, 3-Pin D2PAK, Tape and Reel; DatasheetVersion: 1/11/2011; PackageVersion: 2011; PackageDescription: 3-Pin Transistor Outline Package 2.54 mm Pitch, 15.4 mm Lead Span (D2PAK); ComponentLink2URL: http://www.st.com/internet/com/TECHNICAL_RESOURCES/TECHNICAL_LITERATURE/DATASHEET/CD00000455.pdf; PackageReference: TO-263; ComponentLink1Description: Manufacturer URL; ComponentLink2Description: Datasheet; ComponentLink1URL: http://www.st.com
U12 = CMP-0475-00250-1: High Voltage, Low Quiescent Current Inverting Charge Pump, 4.5 to 32 V Vin, 12-pin SOP (MSE-12-EDP), -40 to 125 degC, Pb-Free; Manufacturer: Linear Technology; Vin Max(V): 32; Max Iout(mA): 100; Isupply(mA): 0.06; Vin Min(V): 4.5; Ishutdown(uA): 2; Frequency(kHz): 500; Voutput: -Vin; RoHS: TRUE; ComponentLink3Description: Package Specification; Mounting Technology: Surface Mount; PackageReference: MSE-12-EDP; PackageVersion: Rev. G, 05/2013; ComponentLink1Description: Manufacturer URL; PartNumber: LTC3261IMSE#PBF; DatasheetVersion: Rev. B; ComponentLink2URL: http://cds.linear.com/docs/en/datasheet/3261fb.pdf; PackageDescription: 12-Pin Plastic MSOP, Exposed Die Pad, Body 4.039 x 3 mm, Pitch 0.65 mm; ComponentLink3URL: http://cds.linear.com/docs/en/packaging/05081666_G_MSE12.pdf; ComponentLink2Description: Datasheet; ComponentLink1URL: http://www.linear.com/
U13 = CMP-0062-01832-3: 3-Terminal Adjustable Negative Regulator, 4-pin SOT-223, Pb-Free; Manufacturer: Texas Instruments; PackageTopMarking: XYTT*N02A; CompType: LDO IC; PowerWise: N; Code_IPC: SOT223-4; ComponentLink1URL: http://www.ti.com/general/docs/lit/getliterature.tsp?genericPartNumber=LM337-N&fileType=pdf; PinCount: 4; PackageReference: DCY0004A; Code_JEDEC: TO-261-AA; PackageDescription: Molded SOT-223, 6.50 x 3.56 x 1.6mm Body, 4 Lead, 2.3mm Pitch; ComponentLink1Description: Datasheet URL; RoHS: Y

## Sheet Connector.SchDoc
size B
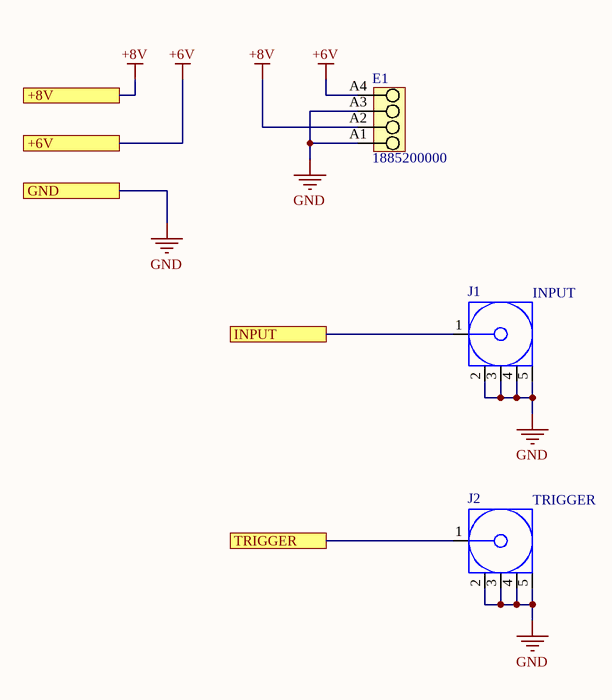
[diagram p5: Connector.SchDoc]

### Parts
E1  1885200000  [LSF_SMT_3_5_135_04]
J1  INPUT  [MOLX-731000114_V]
J2  TRIGGER  [MOLX-731000114_V]

### Ports
+6V, +8V, GND, INPUT, TRIGGER

### Nets
+6V: E1.A4 ; port +6V
+8V: E1.A2 ; port +8V
GND: E1.A1 E1.A3 J1.2 J1.3 J1.4 J1.5 J2.2 J2.3 J2.4 J2.5 ; port GND
NetJ1_1: J1.1 ; port INPUT
NetJ2_1: J2.1 ; port TRIGGER

### Library data of the parts
E1 = CMP-1559-02099-1: OMNIMATE Signal - series LSF; Manufacturer: Weidmueller; Pitch_inch: 0,138 inch; Contact_material: Cu-Leg; Mounting_onto_the_PCB: Reflow solder connection; Rated_voltage_use_group_B_UL_1059: 300 V; Side_termination_characteristic: closed side; Wire_cross_section_AWG_min_UL_1059: AWG 24; Solid_min_H05_07_V_U: 0,2 mm²; No_of_poles: 4; Pitch_mm: 3,5 mm; Solder_pin_length_mm: 1,5 mm; Wire_cross_section_AWG_max_UL_1059: AWG 16; Contact_surface: tinned; Solid_max_H05_07_V_U: 1,5 mm²; Short_text_for_material: LSF-SMT 3.50/04/135 1.5SN BK TU; Rated_current_min_no_of_poles_TU_20_deg_C: 19 A; Rated_current_use_group_B_UL_1059: 12 A; Rated_voltage_for_surge_voltage_class_pollution_degree_II_2: 320 V; Insulating_material: LCP GF; UL_94_flammability_rating: V-0; ComponentLink1URL: http://www.weidmueller.com/; ComponentLink1Description: Manufacturer URL; ComponentLink2URL: http://catalog.weidmueller.com/catalog/Start.do?localeId=en&ObjectID=1885200000; PackageReference: LSF_SMT_3_5_135_04; Qty: 37 PCS; Revision: V1; ComponentLink2Description: URL Link1; PartNumber: 1885200000; Packaging: Tube; Colour: Black
J1 J2 = CMP-2000-05487-1: SMA Right-Angle PCB Jack Receptacle, Brass Body, Gold Plated, 50 Ohm, 5-Pin THD, RoHS, Tray; Manufacturer: Molex; Datasheet Version: 09/2016; Package Description: 5-Pin Through Hole Device, Body 14.8 x 6.35 mm, Pitch 2.54 mm; Datasheet URL: http://www.molex.com/webdocs/datasheets/pdf/en-us/0731000114_RF_COAX_CONNECTORS.pdf; Manufacturer URL: http://www.molex.com/; Package Reference: 731000114; Mounting Technology: ThroughHole; Package URL: http://www.molex.com/pdm_docs/sd/731000114_sd.pdf

## Sheet CompareVoltage.SchDoc
size B
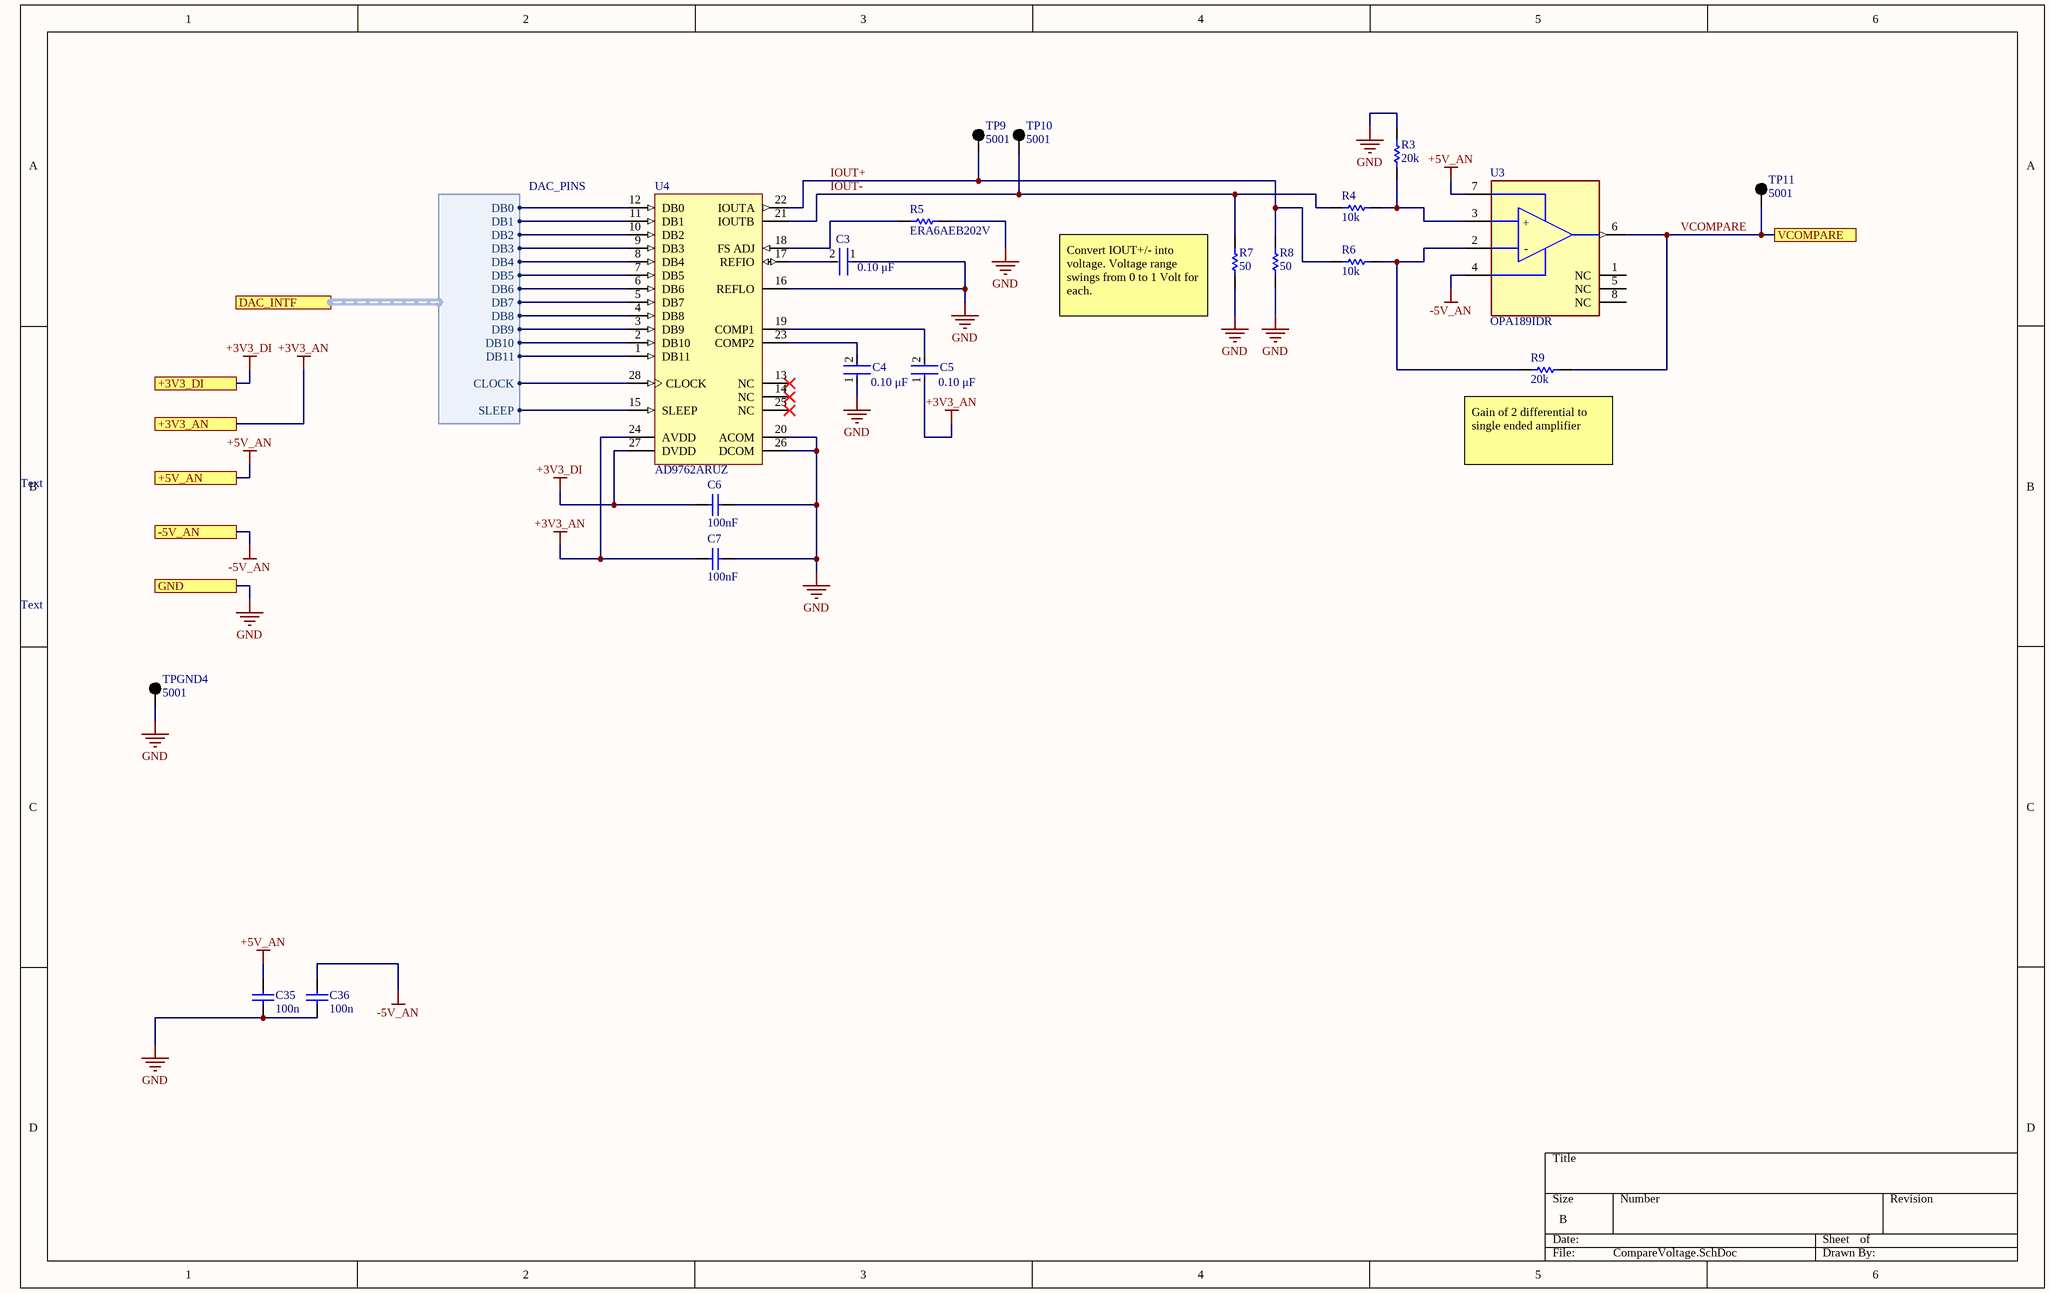
[diagram p6: CompareVoltage.SchDoc]

### Parts
C3  value 0.10 μF  [FP-C1206C-EB-MFG]  (hidden comment: C1206C104J3GACTU)
C4  value 0.10 μF  [FP-C1206C-EB-MFG]  (hidden comment: C1206C104J3GACTU)
C5  value 0.10 μF  [FP-C1206C-EB-MFG]  (hidden comment: C1206C104J3GACTU)
C6  Capacitance: 100nF  [CAPC1608X90X40ML10T20]  (hidden comment: CC0603KRX7R9BB104)
C7  Capacitance: 100nF  [CAPC1608X90X40ML10T20]  (hidden comment: CC0603KRX7R9BB104)
C35  value 100n  [CAPC2013X88X50NL20T25]  (hidden comment: C0805C104K5RACTU)
C36  value 100n  [CAPC2013X88X50NL20T25]  (hidden comment: C0805C104K5RACTU)
R3  20k  [RESC1609X50X30LL10T20]
R4  10k  [RESC1609X50X30NL8T20]
R5  ERA6AEB202V  [RESC2013X60X40ML20T25]
R6  10k  [RESC1609X50X30NL8T20]
R7  Resistance: 50  [RESC1609X50X30NL10T20]  (hidden comment: CRCW060350R0FKEA)
R8  Resistance: 50  [RESC1609X50X30NL10T20]  (hidden comment: CRCW060350R0FKEA)
R9  20k  [RESC1609X50X30LL10T20]
TP9  5001  [KSTN-5001]
TP10  5001  [KSTN-5001]
TP11  5001  [KSTN-5001]
TPGND4  5001  [KSTN-5001]
U3  OPA189IDR  [FP-D0008A-MFG]
U4  AD9762ARUZ  [RU-28_L]

### Ports
+3V3_AN, +3V3_DI, +5V_AN, -5V_AN, DAC_INTF (harness DAC_PINS), GND, VCOMPARE

### Harnesses
DAC_PINS: DB0, DB1, DB2, DB3, DB4, DB5, DB6, DB7, DB8, DB9, DB10, DB11, CLOCK, SLEEP

### Nets
+3V3_AN: C5.1 C7.2 U4.24(AVDD) ; port +3V3_AN
+3V3_DI: C6.2 U4.27(DVDD) ; port +3V3_DI
+5V_AN: C35.2 U3.7(V+) ; port +5V_AN
-5V_AN: C36.2 U3.4(V-) ; port -5V_AN
GND: C3.1 C4.1 C6.1 C7.1 C35.1 C36.1 R3.2 R5.2 R7.1 R8.1 TPGND4.1 U4.16(REFLO) U4.20(ACOM) U4.26(DCOM) ; port GND
DAC_CLOCK: U4.28(CLOCK) ; port DAC_INTF.CLOCK
DAC_DB0: U4.12(DB0) ; port DAC_INTF.DB0
DAC_DB1: U4.11(DB1) ; port DAC_INTF.DB1
DAC_DB2: U4.10(DB2) ; port DAC_INTF.DB2
DAC_DB3: U4.9(DB3) ; port DAC_INTF.DB3
DAC_DB4: U4.8(DB4) ; port DAC_INTF.DB4
DAC_DB5: U4.7(DB5) ; port DAC_INTF.DB5
DAC_DB6: U4.6(DB6) ; port DAC_INTF.DB6
DAC_DB7: U4.5(DB7) ; port DAC_INTF.DB7
DAC_DB8: U4.4(DB8) ; port DAC_INTF.DB8
DAC_DB9: U4.3(DB9) ; port DAC_INTF.DB9
DAC_DB10: U4.2(DB10) ; port DAC_INTF.DB10
DAC_DB11: U4.1(DB11) ; port DAC_INTF.DB11
DAC_SLEEP: U4.15(SLEEP) ; port DAC_INTF.SLEEP
IOUT+: R6.1 R8.2 TP9.1 U4.22(IOUTA)
IOUT-: R4.1 R7.2 TP10.1 U4.21(IOUTB)
VCOMPARE: R9.2 TP11.1 U3.6(OUT) ; port VCOMPARE
NetC3_2: C3.2 U4.17(REFIO)
NetC4_2: C4.2 U4.23(COMP2)
NetC5_2: C5.2 U4.19(COMP1)
NetR3_1: R3.1 R4.2 U3.3(+IN)
NetR5_1: R5.1 U4.18(FS_ADJ)
NetR6_2: R6.2 R9.1 U3.2(-IN)

Not connected (* = marked no-connect by the designer): U3 1(NC) 5(NC) 8(NC); U4 13(NC)* 14(NC)* 25(NC)*

### Notes on the sheet
- (near R7) Convert IOUT+/- into voltage. Voltage range swings from 0 to 1 Volt for each.
- Text
- (near R9) Gain of 2 differential to single ended amplifier
- (in symbol CMP-04895-000042-1) +; -

### Library data of the parts
C3-C5 = CMP-03020-000180-1: CAP CER 0.1UF 25V 5% NP0 1206; Manufacturer: KEMET; Tolerance: 0.05; Temperature Coefficient: 15%; Automotive Grade: Grade 0; Material: Ceramic; Temperature Characteristic: C0G; Automotive: Yes; Ipc Land Pattern Name: CAPC320160X78; ComponentLink2Description: Datasheet; Height: 0.88mm; Digikey Description: CAP CER 0.1UF 25V 5% NP0 1206; Capacitance: 0.10 μF; Category: Cap; Package: C1206C-EB; Device Class L3: Ceramic Capacitors; Octopart: https://octopart.com/c1206c104j3gactu-kemet-9145095; Device Class L1: Passive Components; Device Class L2: Capacitors; Voltage Rating: 25 V; Lead Free: Yes; Mouser Description: Multilayer Ceramic Capacitors MLCC - SMD/SMT 25volts 0.1uF 5% C0G; Temperature: -55°C to +150°C; ComponentLink2URL: https://content.kemet.com/datasheets/KEM_C1007_X8R_ULTRA_150C_SMD.pdf; RoHS: TRUE; Temperature Range High: +150°C; Temperature Range Low: -55°C; Manufacturer Part Number: C1206C104J3GACTU
C6 C7 = CMP-2100-03601-1: Chip Capacitor, 100 nF, +/- 10%, 50 V, -55 to 125 degC, 0603 (1608 Metric), RoHS, Tape and Reel; Manufacturer: Yageo; Voltage Rating: 50V; Dielectric: X7R; Dielectric Material: Ceramic; Case Code (Metric): 1608; Tolerance: 10%; Lead Free: LeadFree; Case/Package: 0603; REACH SVHC: NoSVHC; Length: 1.6mm; RoHSCompliant: True; Manufacturer URL: http://www.yageo.com/; Datasheet URL: http://www.yageo.com/documents/recent/UPY-GPHC_X7R_6.3V-to-50V_15.pdf; Packaging: TapeandReel; Case Code (Imperial): 0603; Thickness: 0.035inch; Radiation Hardening: No; Height: 0.8mm; Datasheet Version: Rev. 15, 10/2016; Package Reference: 0603; Package Quantity: 1; Min Operating Temperature: -55degC; Package Description: 2-Pin Surface Mount Device, Body 1.6 x 0.8 mm; Number of Pins: 2; Max Operating Temperature: 125degC; Depth: 0.8mm; Termination: SMD/SMT; Voltage: 50V; Width: 0.031inch
C35 C36 = CMP-2007-00279-1: Manufacturer: Kemet; Part Number: C0805C104K5RACTU
R3 R9 = CMP-2000-03068-1: Manufacturer: Vishay Dale; Part Number: CRCW060320K0FKEA
R4 R6 = CMP-1666-00005-4: Chip Resistor, 10 KOhm, +/- 1%, 100 mW, -55 to 155 degC, 0603 (1608 Metric), RoHS, Tape and Reel; Manufacturer: Vishay Semiconductor; Voltage Rating: 75 V; Max Operating Temperature: 155 degC; PackageDescription: 2-Pin Surface Mount Device, Body 1.575 x 0.85 mm; ComponentLink1Description: Manufacturer URL; RoHSCompliant: true; PackageReference: 0603; REACH SVHC: Unknown; Length: 1.55 mm; DatasheetVersion: 06/2012; Packaging: Tape and Reel; Min Operating Temperature: -55 degC; Mounting Technology: Surface Mount; ComponentLink2URL: https://datasheet.ciiva.com/11809/0900766b80d98afc-11809037.pdf; Height: 0.45 mm; ComponentLink2Description: Datasheet; Package Quantity: 5000; ComponentLink1URL: http://www.vishay.com/
R5 = CMP-2001-00609-1: Manufacturer: Panasonic; Part Number: ERA6AEB202V
R7 R8 = CMP-2000-03436-1: Manufacturer: Vishay Dale; Part Number: CRCW060350R0FKEA
TP9-TP11 TPGND4 = CMP-2000-05181-1: as TP2 on sheet Trigger; Datasheet URL: https://ciiva.com/datasheet-click-2917627?src=ciiva&sig=bd195616; Mounting Type: 0.040"(1.02mm)HoleDiameter; Family: TestPoints; RoHS Information: RoHSComplianceStatement; Datasheet Version: Rev. G, 12/2008; Color: Black; Category: TestandMeasurement; Standard Package: 100; Manufacturer URL: http://www.keyelco.com/; Material: Base,Nylon46,UL94V-0; Type: PCTestPoint,Miniature; Terminal: 0.010"x0.020"(0.25mmx0.51mm)PhosphorBronzeWire,SilverPlated; Series: THM; Packaging: Bulk
U3 = CMP-04895-000042-1: 36V ZERO DRIFT OP-AMP; Manufacturer: Texas Instruments; Input Offset Voltage: 0.0004mV; Max Dual Supply Voltage: 18V; Number Of Channels: 1; Min Dual Supply Voltage: 2.25V; Nominal Supply Current: 1.3mA; Max Junction Temp: +150°C; Standoff Height: 0.11mm; Output Current Per Channel: 65mA; Voltage Gain: 170dB; Gain Bandwidth: 14MHz; Min Supply Voltage: 4.5V; Input Bias Current: 0.00007uA; Manufacturer Part Number: OPA189IDR; Category: IC; Max Supply Voltage: 36V; Mouser Description: Op Amp Single Zero Drift Amplifier R-R O/P ±18V/36V 8-Pin SOIC T/R; Device Class L1: Integrated Circuits (ICs); RoHS: TRUE; Ipc Land Pattern Name: SOIC127P600X175-8; Ambient Temperature Range Low: -40°C; ComponentLink2URL: http://www.ti.com/lit/ds/symlink/opa189.pdf; Automotive: No; Device Class L3: Amplifiers - Op Amps; ComponentLink2Description: Datasheet; Temperature: -40°C to +125°C; Lead Free: Yes; Temperature Range High: +125°C; Height: 1.75mm; Ambient Temperature Range High: +125°C; Temperature Range Low: -40°C; Package: D0008A; Octopart: https://octopart.com/opa189idr-texas+instruments-84619764; Device Class L2: Linear ICs; Digikey Description: 36V ZERO DRIFT OP-AMP
U4 = CMP-0318-01862-2: Single 12-Bit TxDAC, 125 Msps, -40 to +85 degC, RU-28, Pb-Free, Tube; Generic Part Number: AD9762; Manufacturer: Analog Devices; # DAC Outputs: 1; Single Supply: Yes; Resolution (Bits): 12; Settling Time: 35ns; Max V+: 5.5V; Op Pwr Diss: 160mW; PackageVersion: 2005; RevisionNote: Component URL fixed; Code_JEDEC: MO-153-AE; PackageReference: RU-28; Packing: Tube; DatasheetVersion: Rev.B; RoHS: Y; Mounting Technology: Surface Mount; PartNumber: AD9762ARUZ; ComponentLink2Description: Datasheet; ComponentLink2URL: http://www.analog.com/static/imported-files/data_sheets/AD9762.pdf; PackageDescription: 28-Lead Thin Shrink Small Outline Package [TSSOP]; ComponentLink3Description: Package Specification; ComponentLink4Description: Product URL; ComponentLink3URL: http://www.analog.com/static/imported-files/packages/249854663RU_28.pdf; ComponentLink4URL: http://www.analog.com/en/digital-to-analog-converters/da-converters/ad9762/products/product.html; ComponentLink1URL: http://www.analog.com/en/index.html; ComponentLink1Description: Manufacturer URL

## Nets that join several sheets
+3V3_AN: Power (C9.2 R10.2 U7.4), CompareVoltage (C5.1 C7.2 U4.24)
+3V3_DI: Trigger (16 pins), Input-Comparator (11 pins), Power (C13.2 R13.2 U9.4), CompareVoltage (C6.2 U4.27)
+5V_AN: Input-Comparator (C21.1 C33.1 U1.5 U1.16), Power (C11.2 R12.1 U8.4), CompareVoltage (C35.2 U3.7)
+5V_FPGA: FPGA (8 pins), Power (C2.2 R1.1 U2.4)
+6V: Power (C8.2 C12.2 U7.3 U9.3), Connector (E1.A4)
+8V: Power (7 pins), Connector (E1.A2)
-5V_AN: Input-Comparator (C22.2 U1.13), Power (R33.1 TP8.1 U13.3), CompareVoltage (C36.2 U3.4)
GND: Trigger (18 pins), Input-Comparator (19 pins), FPGA (32 pins), Power (25 pins), Connector (10 pins), CompareVoltage (14 pins)
D0: Trigger (U10.2), FPGA (DB1.49)
D1: Trigger (U10.1), FPGA (DB1.48)
D2: Trigger (U10.32), FPGA (DB1.46)
D3: Trigger (U10.31), FPGA (DB1.45)
D4: Trigger (U10.30), FPGA (DB1.43)
D5: Trigger (U10.29), FPGA (DB1.42)
D6: Trigger (U10.27), FPGA (DB1.40)
D7: Trigger (U10.26), FPGA (DB1.39)
D8: Trigger (U10.25), FPGA (DB1.37)
D9: Trigger (U10.23), FPGA (DB1.36)
DAC_CLOCK: FPGA (CB1.2), CompareVoltage (U4.28)
DAC_DB0: FPGA (CB1.20), CompareVoltage (U4.12)
DAC_DB1: FPGA (CB1.18), CompareVoltage (U4.11)
DAC_DB2: FPGA (CB1.17), CompareVoltage (U4.10)
DAC_DB3: FPGA (CB1.15), CompareVoltage (U4.9)
DAC_DB4: FPGA (CB1.14), CompareVoltage (U4.8)
DAC_DB5: FPGA (CB1.12), CompareVoltage (U4.7)
DAC_DB6: FPGA (CB1.11), CompareVoltage (U4.6)
DAC_DB7: FPGA (CB1.9), CompareVoltage (U4.5)
DAC_DB8: FPGA (CB1.8), CompareVoltage (U4.4)
DAC_DB9: FPGA (CB1.6), CompareVoltage (U4.3)
DAC_DB10: FPGA (CB1.5), CompareVoltage (U4.2)
DAC_DB11: FPGA (CB1.3), CompareVoltage (U4.1)
DAC_SLEEP: FPGA (CB1.21), CompareVoltage (U4.15)
Latch-Enable_N: Trigger (U10.20), Input-Comparator (R16.1 R20.2 U1.6)
Latch-Enable_P: Trigger (U10.21), Input-Comparator (R17.1 R21.2 U1.7)
NetBB1_2: Trigger (TP2.1 U6.4), FPGA (BB1.2)
NetBB1_3: Input-Comparator (TP1.1 U5.6), FPGA (BB1.3)
NetBB1_5: Trigger (U6.16), FPGA (BB1.5)
NetDB1_2: Trigger (U6.8), FPGA (DB1.2)
NetJ1_1: Input-Comparator (U1.3), Connector (J1.1)
NetJ2_1: Trigger (U6.9), Connector (J2.1)
VCOMPARE: Input-Comparator (U1.1 U1.2), CompareVoltage (R9.2 TP11.1 U3.6)